# Altium project 724452_RPL-HX_Mobile_AEP_Rev0p91.PrjPcb (part 2 of 13)

## Sheet 0004_INDEX -3.SchDoc
size 848 x 558 mm
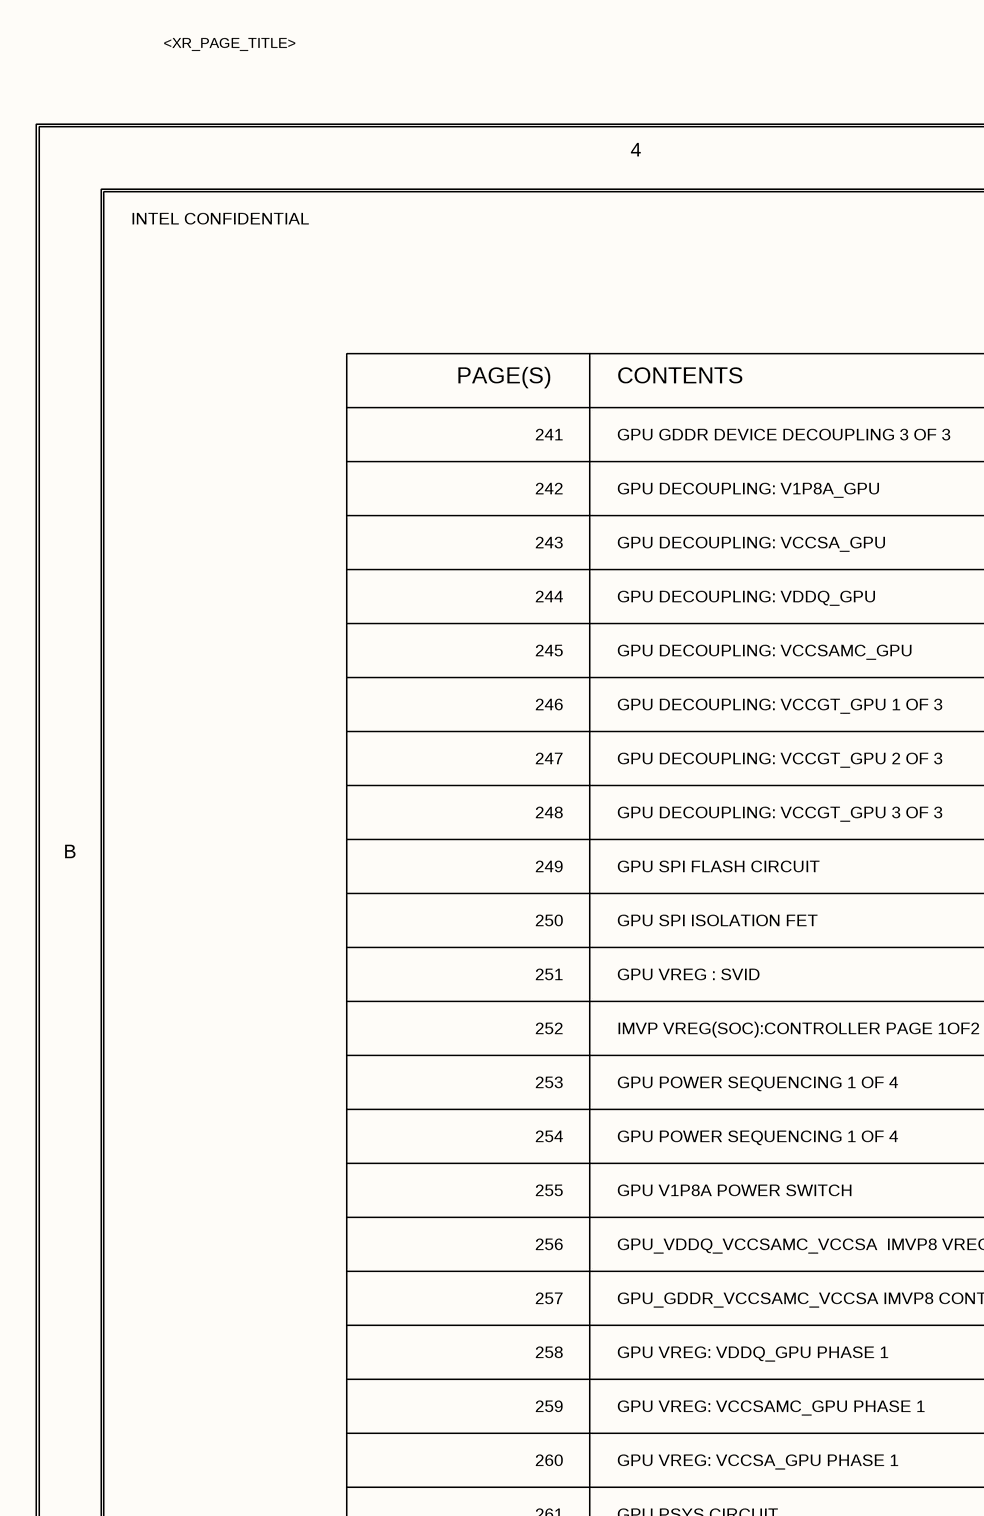
[diagram p18: 0004_INDEX -3.SchDoc, top left]
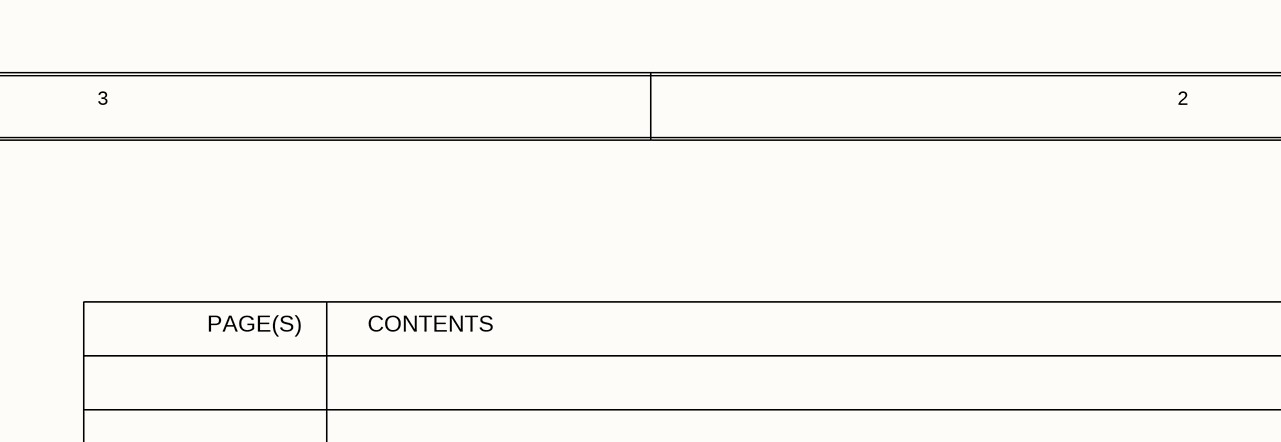
[diagram p19: 0004_INDEX -3.SchDoc, top middle]
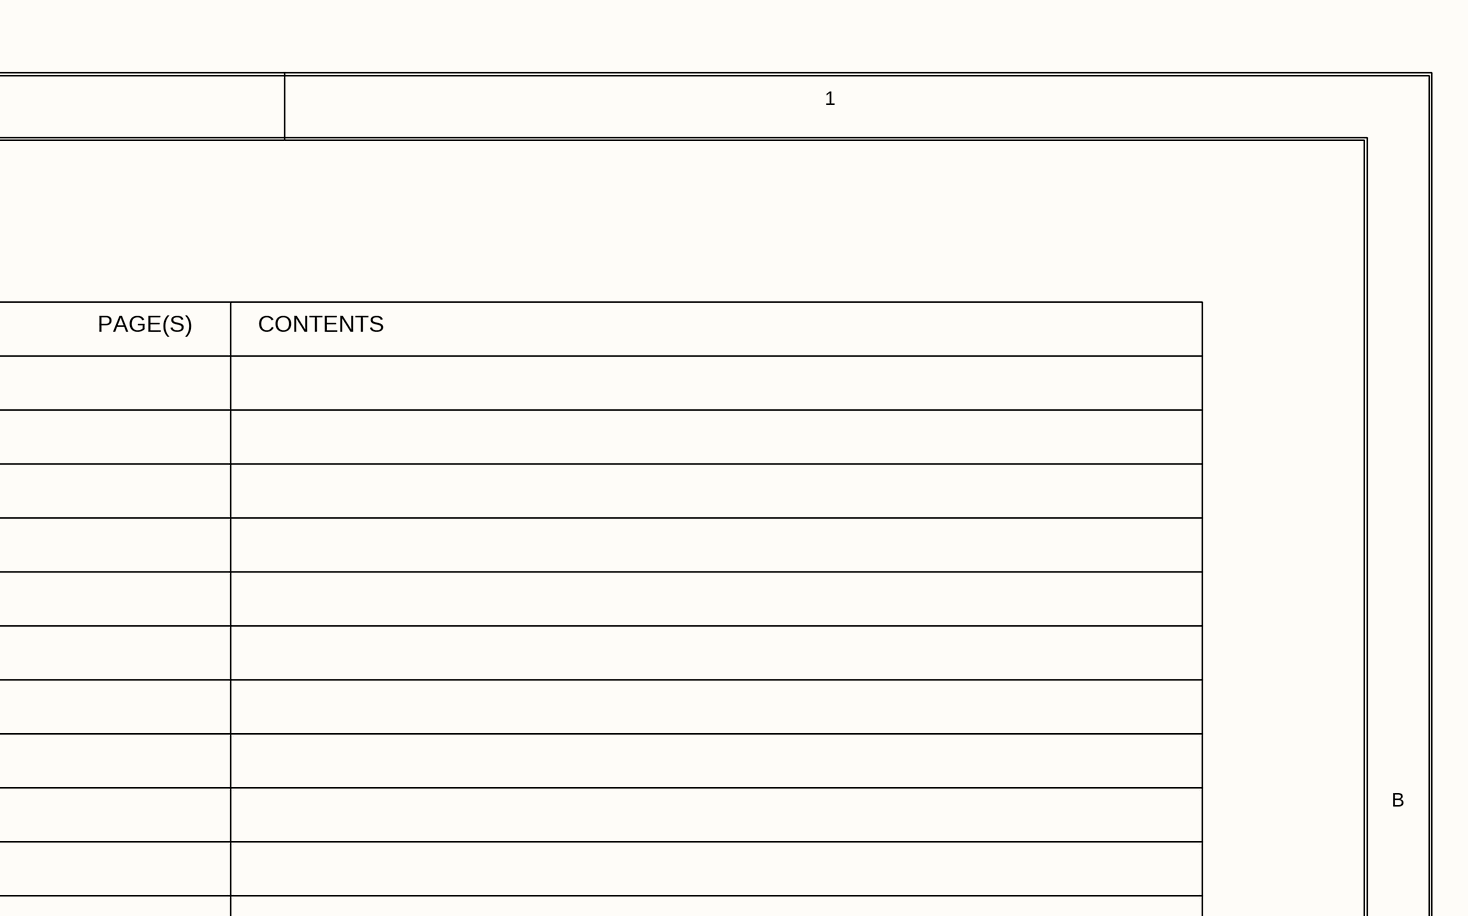
[diagram p20: 0004_INDEX -3.SchDoc, top right]
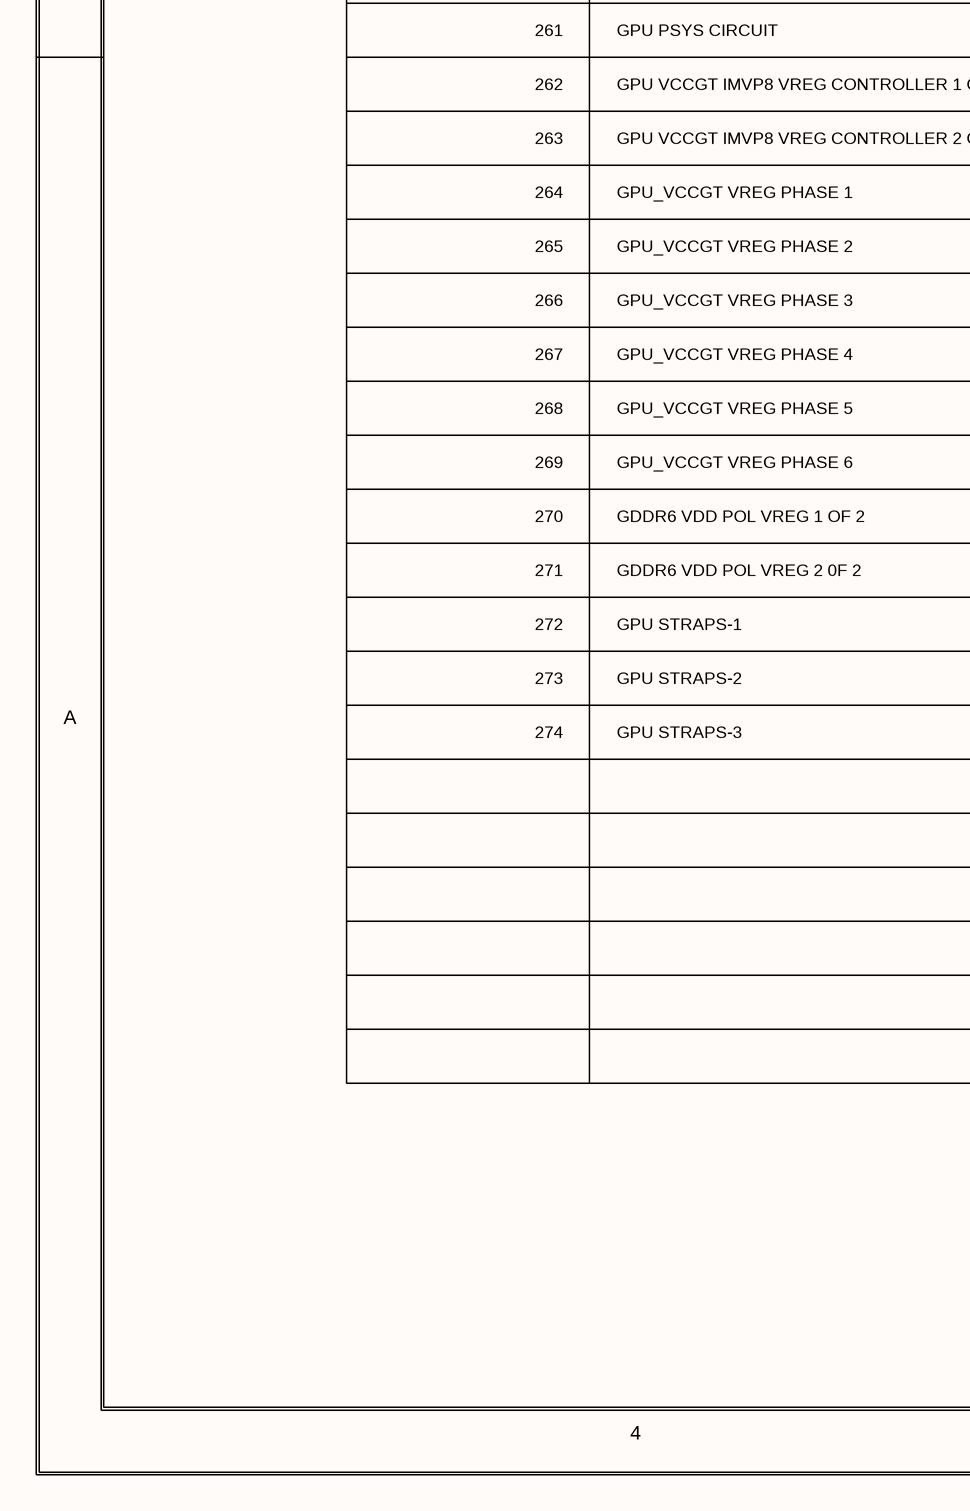
[diagram p21: 0004_INDEX -3.SchDoc, bottom left]
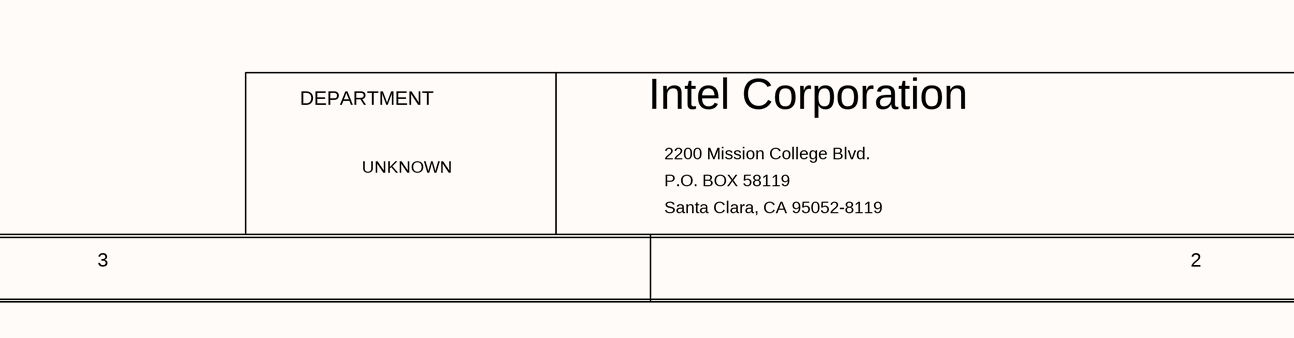
[diagram p22: 0004_INDEX -3.SchDoc, bottom middle]
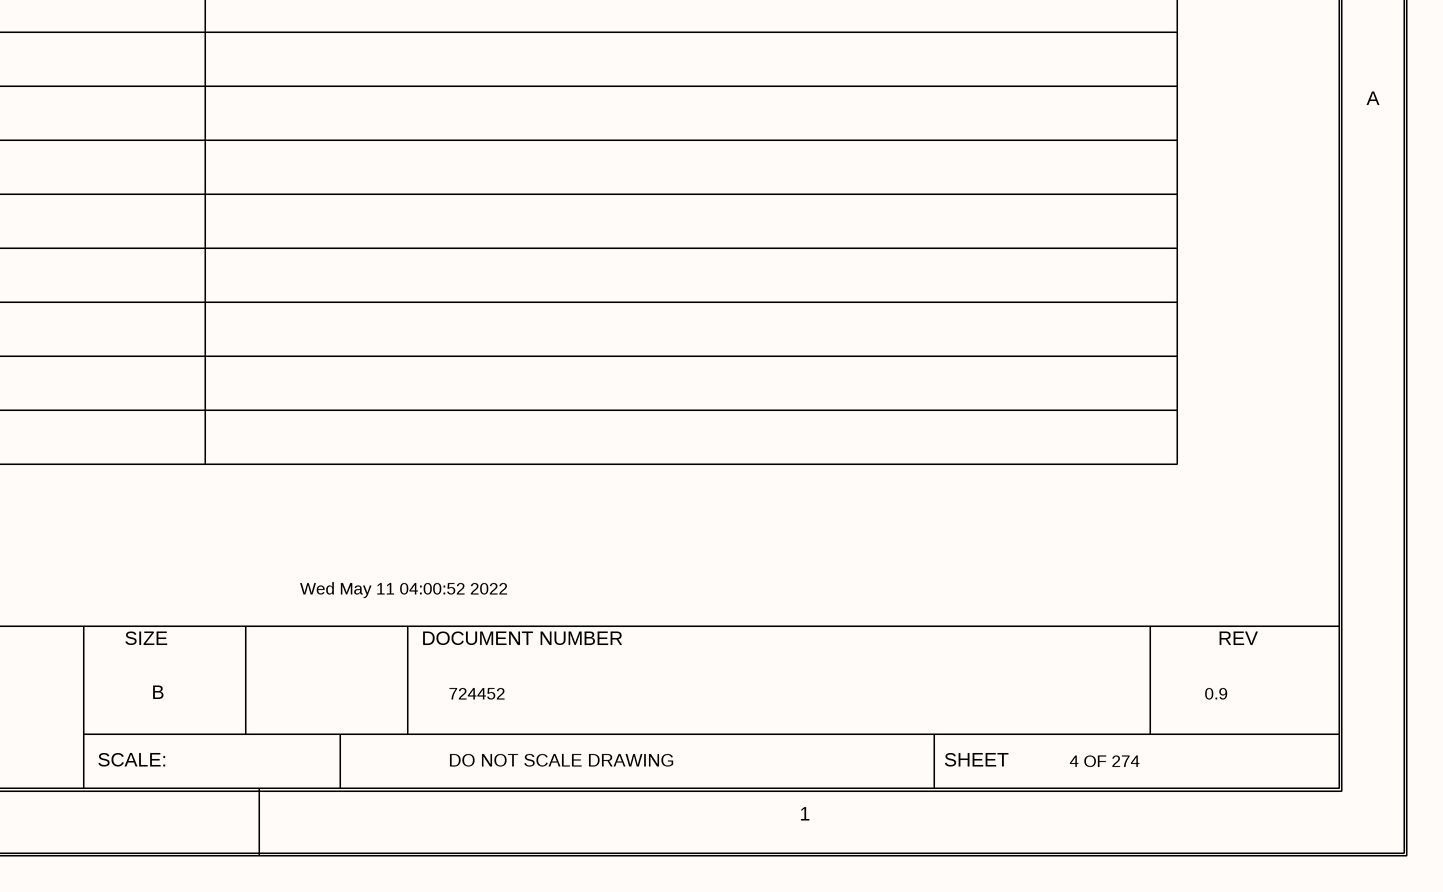
[diagram p23: 0004_INDEX -3.SchDoc, bottom right]

### Notes on the sheet
- <XR_PAGE_TITLE>
- 4
- 3
- 2
- 1
- INTEL CONFIDENTIAL
- PAGE(S)
- CONTENTS
- 241
- GPU GDDR DEVICE DECOUPLING 3 OF 3
- 242
- GPU DECOUPLING: V1P8A_GPU
- 243
- GPU DECOUPLING: VCCSA_GPU
- 244
- 245
- GPU DECOUPLING: VCCSAMC_GPU
- GPU DECOUPLING: VDDQ_GPU
- 246
- GPU DECOUPLING: VCCGT_GPU 1 OF 3
- 247
- GPU DECOUPLING: VCCGT_GPU 2 OF 3
- B
- 248
- GPU DECOUPLING: VCCGT_GPU 3 OF 3
- 249
- 250
- GPU SPI ISOLATION FET
- GPU SPI FLASH CIRCUIT
- 251
- GPU VREG : SVID
- 252
- IMVP VREG(SOC):CONTROLLER PAGE 1OF2
- 253
- GPU POWER SEQUENCING 1 OF 4
- 254
- 255
- GPU V1P8A POWER SWITCH
- 256
- GPU_VDDQ_VCCSAMC_VCCSA  IMVP8 VREG CONTROLLER
- 257
- GPU_GDDR_VCCSAMC_VCCSA IMVP8 CONTROLLER 2 OF 2
- 258
- GPU VREG: VDDQ_GPU PHASE 1
- 259
- 260
- GPU VREG: VCCSA_GPU PHASE 1
- GPU VREG: VCCSAMC_GPU PHASE 1
- 261
- GPU PSYS CIRCUIT
- 262
- GPU VCCGT IMVP8 VREG CONTROLLER 1 OF 2
- 263
- GPU VCCGT IMVP8 VREG CONTROLLER 2 OF 2
- 264
- 265
- GPU_VCCGT VREG PHASE 2
- GPU_VCCGT VREG PHASE 1
- 266
- GPU_VCCGT VREG PHASE 3
- 267
- GPU_VCCGT VREG PHASE 4
- 268
- GPU_VCCGT VREG PHASE 5
- 270
- 269
- GDDR6 VDD POL VREG 1 OF 2
- GPU_VCCGT VREG PHASE 6
- 271
- GDDR6 VDD POL VREG 2 0F 2
- 272
- GPU STRAPS-1
- A
- 273
- GPU STRAPS-2
- 274
- GPU STRAPS-3
- Wed May 11 04:00:52 2022
- SIZE
- DOCUMENT NUMBER
- REV
- DEPARTMENT
- Intel Corporation
- 2200 Mission College Blvd.
- 724452
- 0.9
- UNKNOWN
- Santa Clara, CA 95052-8119
- P.O. BOX 58119
- SCALE:
- DO NOT SCALE DRAWING
- SHEET
- 4 OF 274

## Sheet 0005_BLOCK DIAGRAM - MA.SchDoc
size 848 x 558 mm
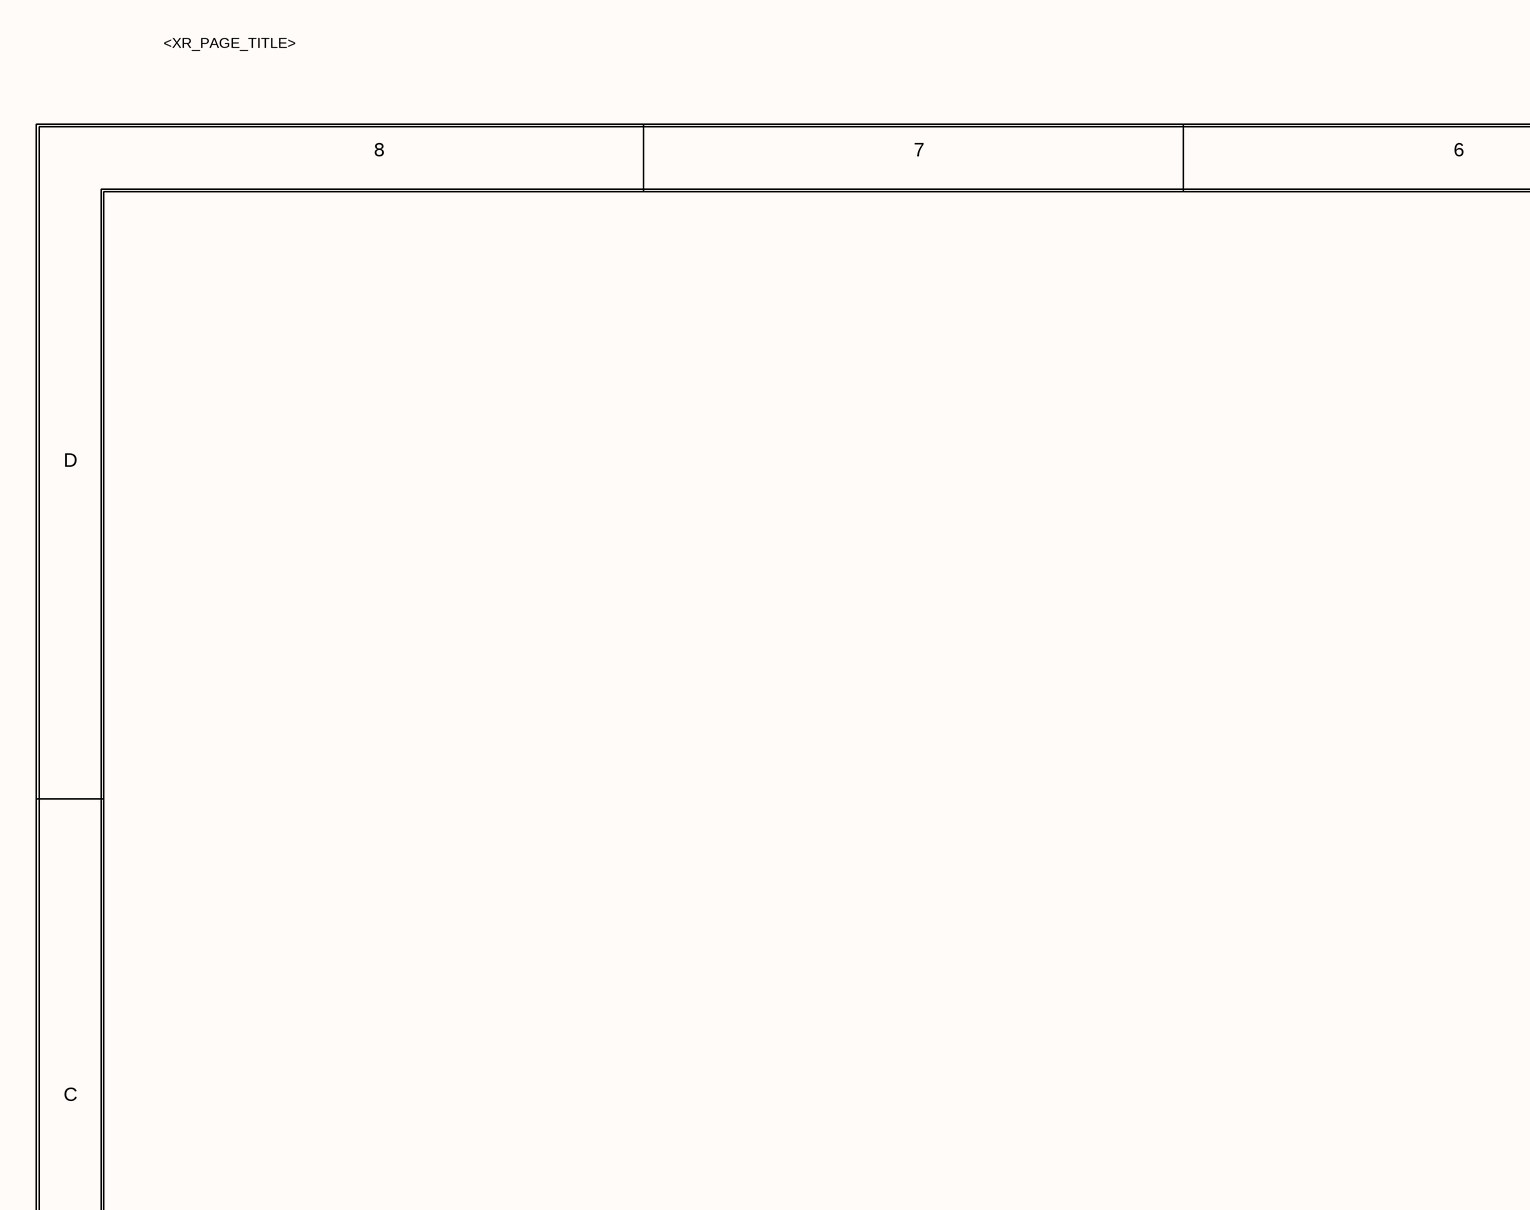
[diagram p24: 0005_BLOCK DIAGRAM - MA.SchDoc, top left]
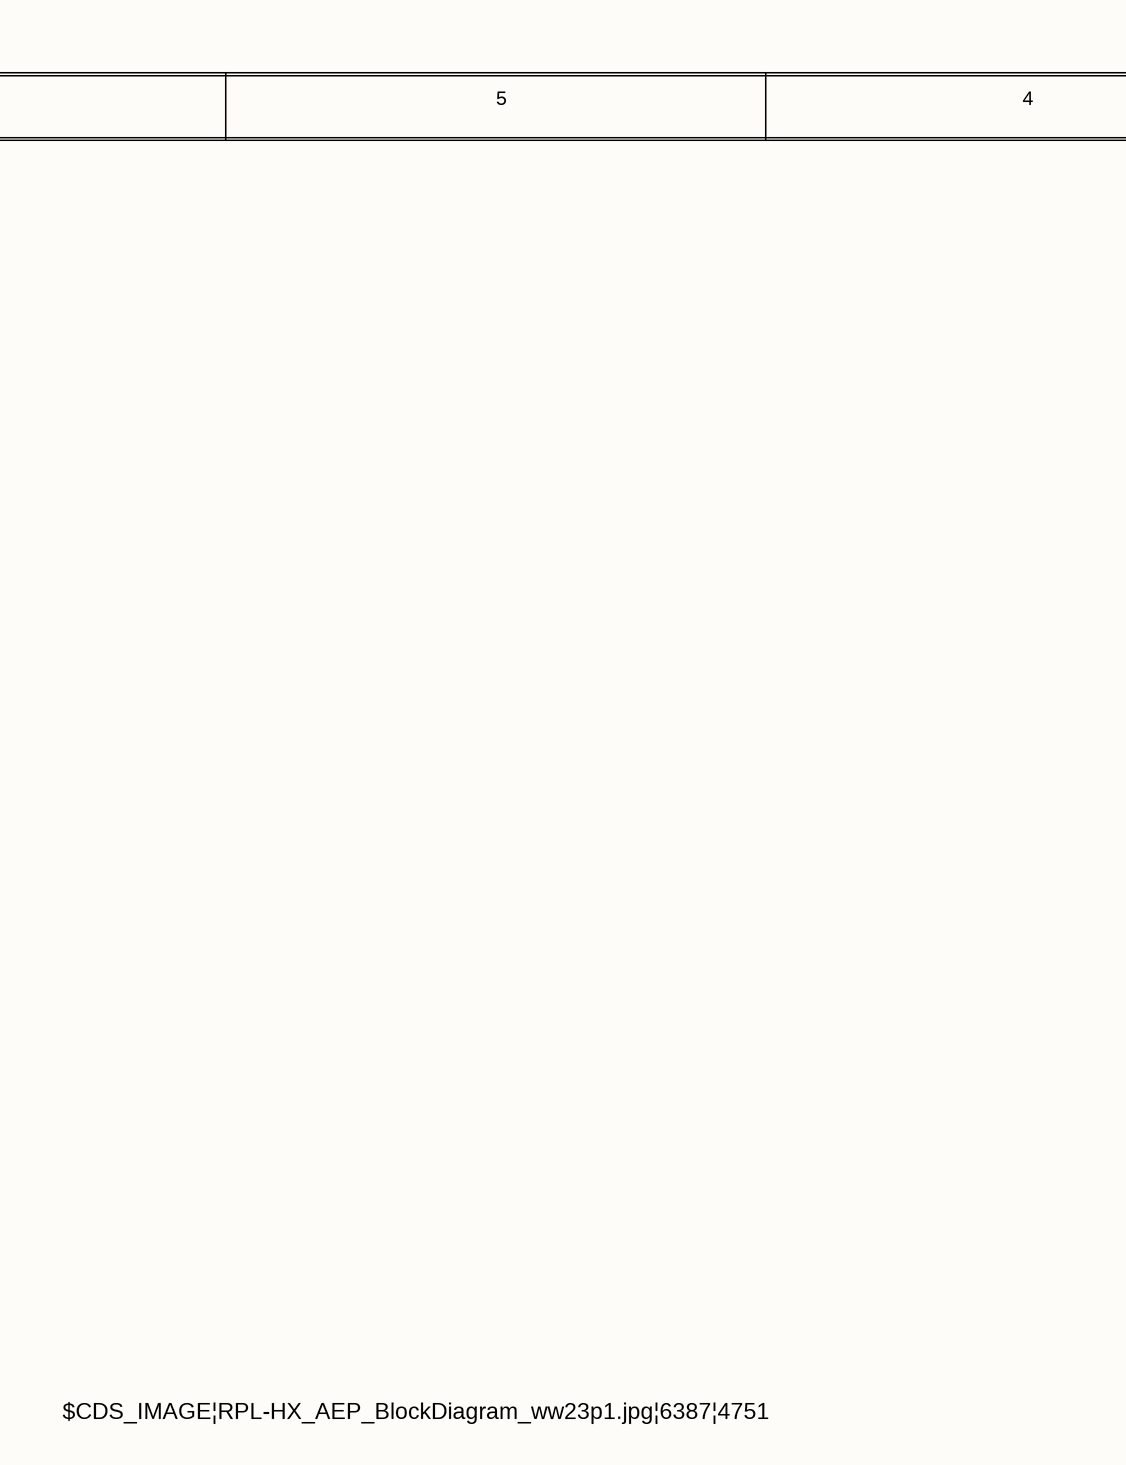
[diagram p25: 0005_BLOCK DIAGRAM - MA.SchDoc, top middle]
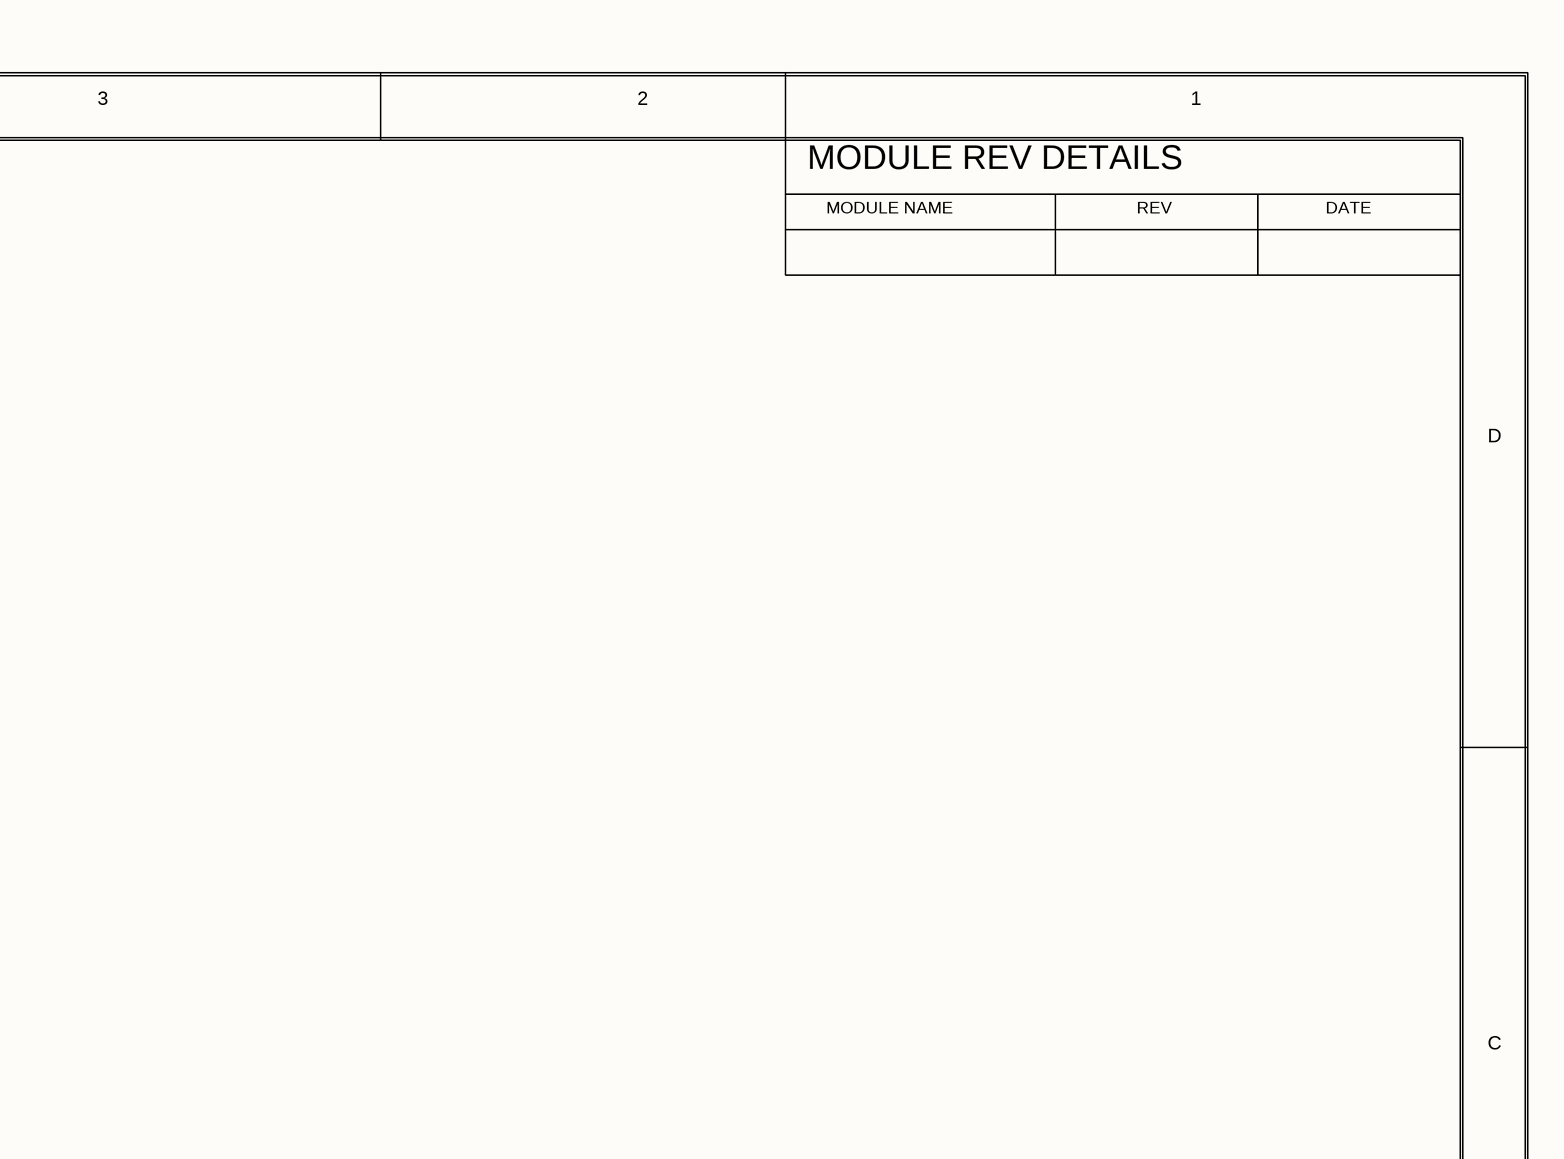
[diagram p26: 0005_BLOCK DIAGRAM - MA.SchDoc, top right]
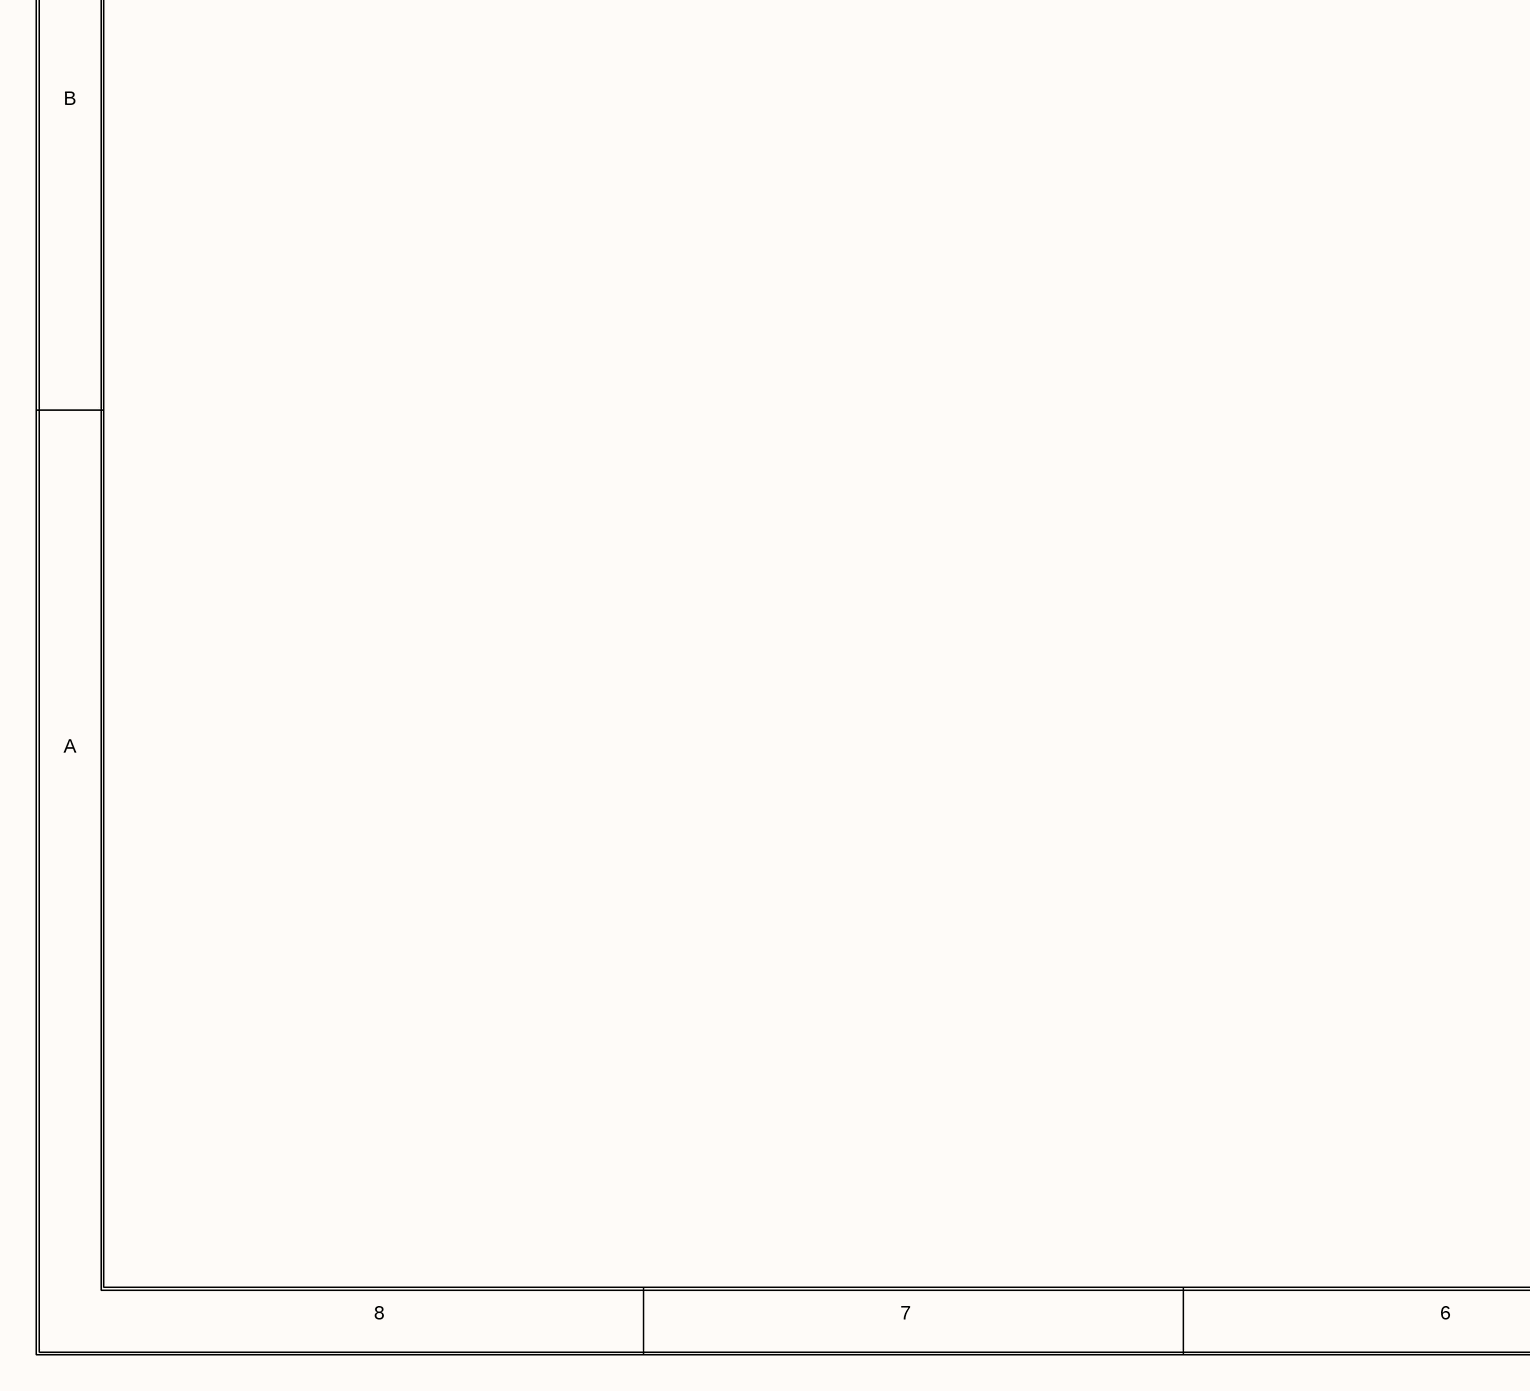
[diagram p27: 0005_BLOCK DIAGRAM - MA.SchDoc, bottom left]
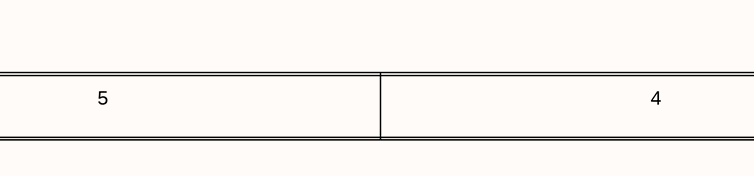
[diagram p28: 0005_BLOCK DIAGRAM - MA.SchDoc, bottom middle]
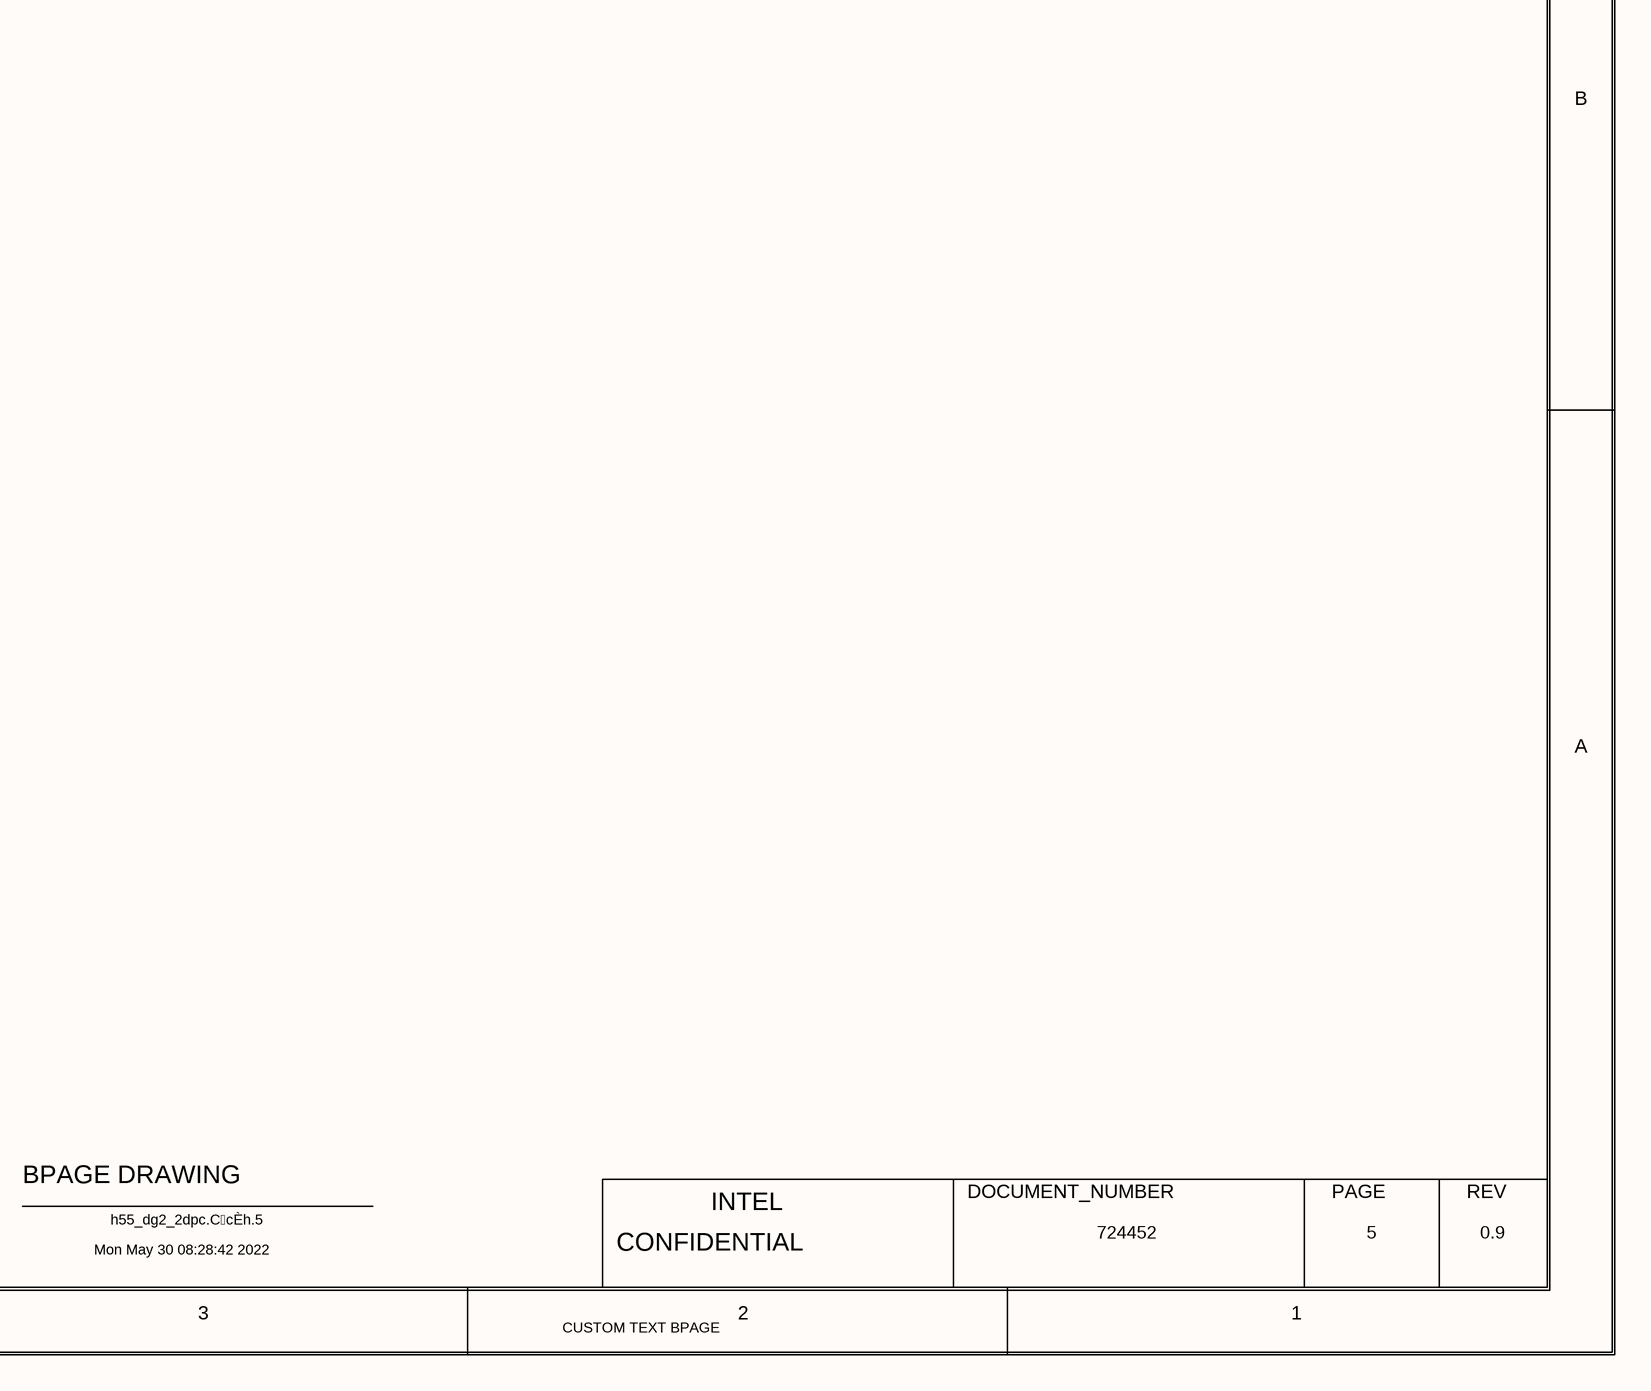
[diagram p29: 0005_BLOCK DIAGRAM - MA.SchDoc, bottom right]

### Notes on the sheet
- <XR_PAGE_TITLE>
- 8
- 7
- 6
- 5
- 4
- 3
- 2
- 1
- MODULE REV DETAILS
- MODULE NAME
- REV
- DATE
- D
- C
- $CDS_IMAGE|RPL-HX_AEP_BlockDiagram_ww23p1.jpg|6387|4751
- B
- A
- BPAGE DRAWING
- INTEL
- DOCUMENT_NUMBER
- PAGE
- Mon May 30 08:28:42 2022
- h55_dg2_2dpc.CcÈh.5
- CONFIDENTIAL
- 724452
- 0.9
- CUSTOM TEXT BPAGE

## Sheet 0006_BLOCK DIAGRAM - PO.SchDoc
size 848 x 558 mm
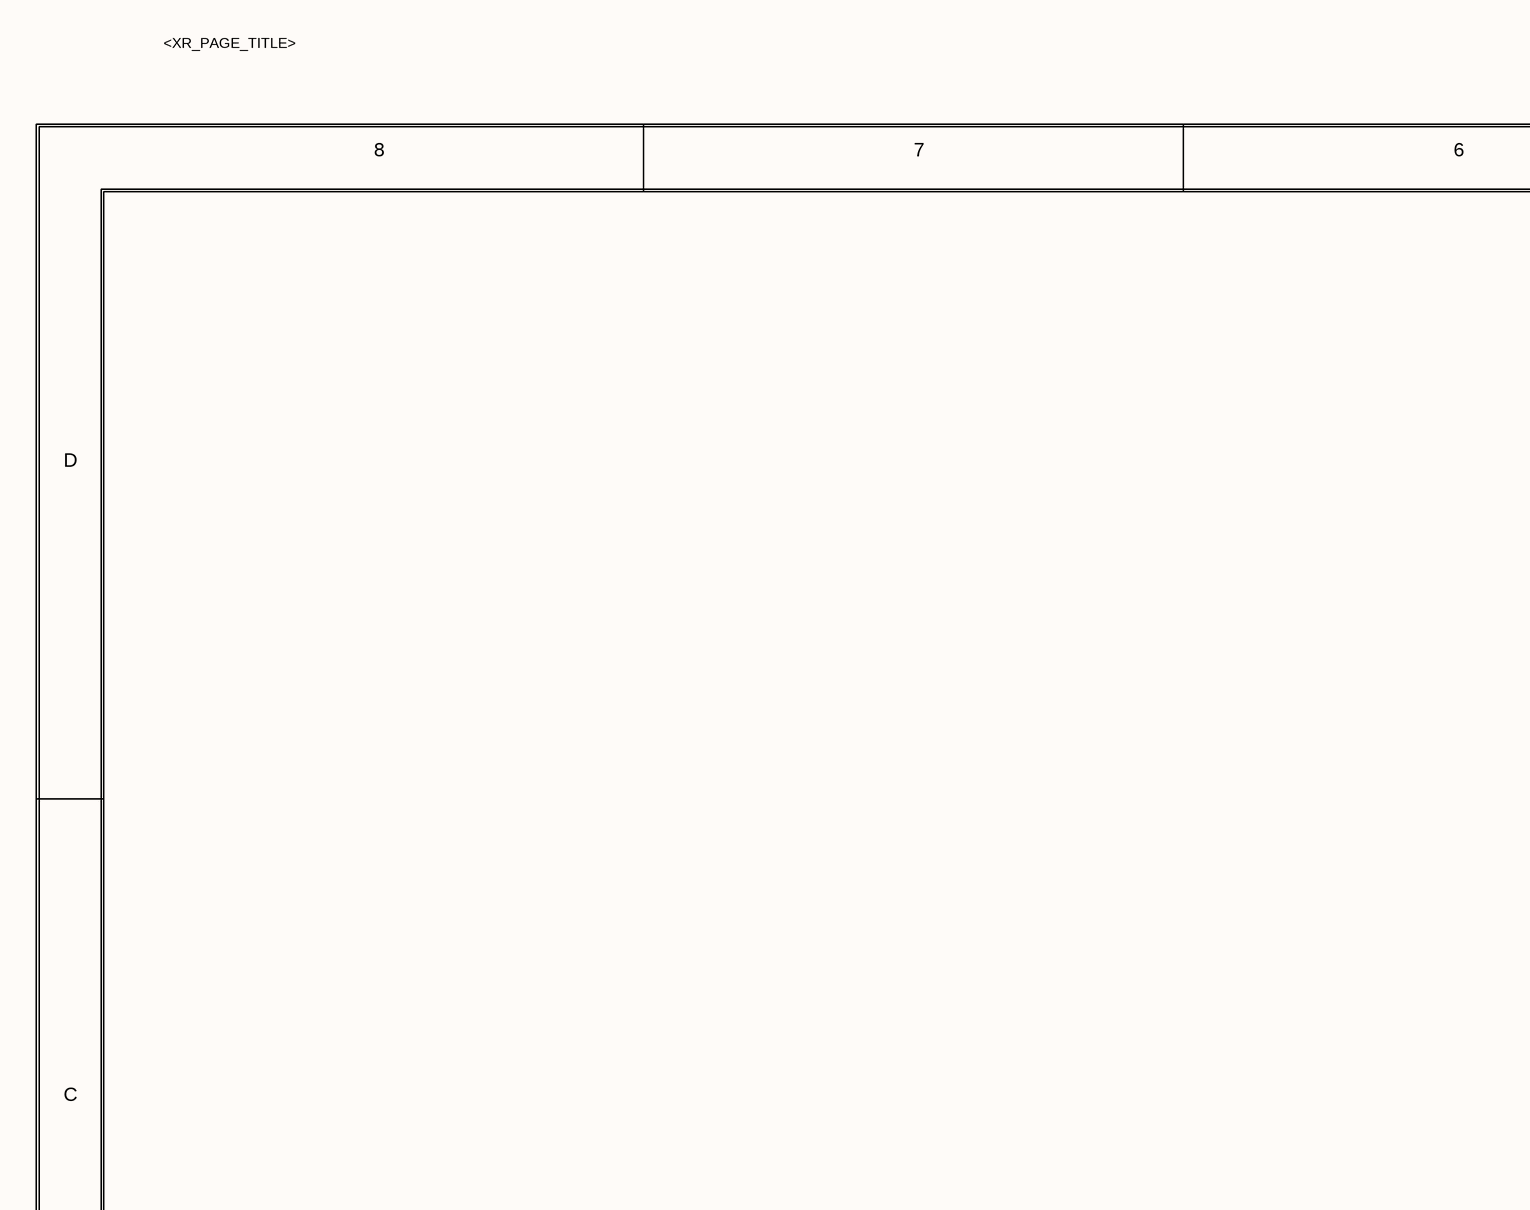
[diagram p30: 0006_BLOCK DIAGRAM - PO.SchDoc, top left]
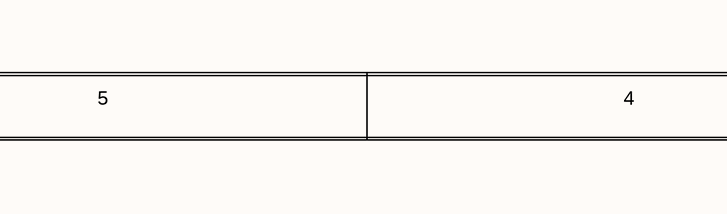
[diagram p31: 0006_BLOCK DIAGRAM - PO.SchDoc, top middle]
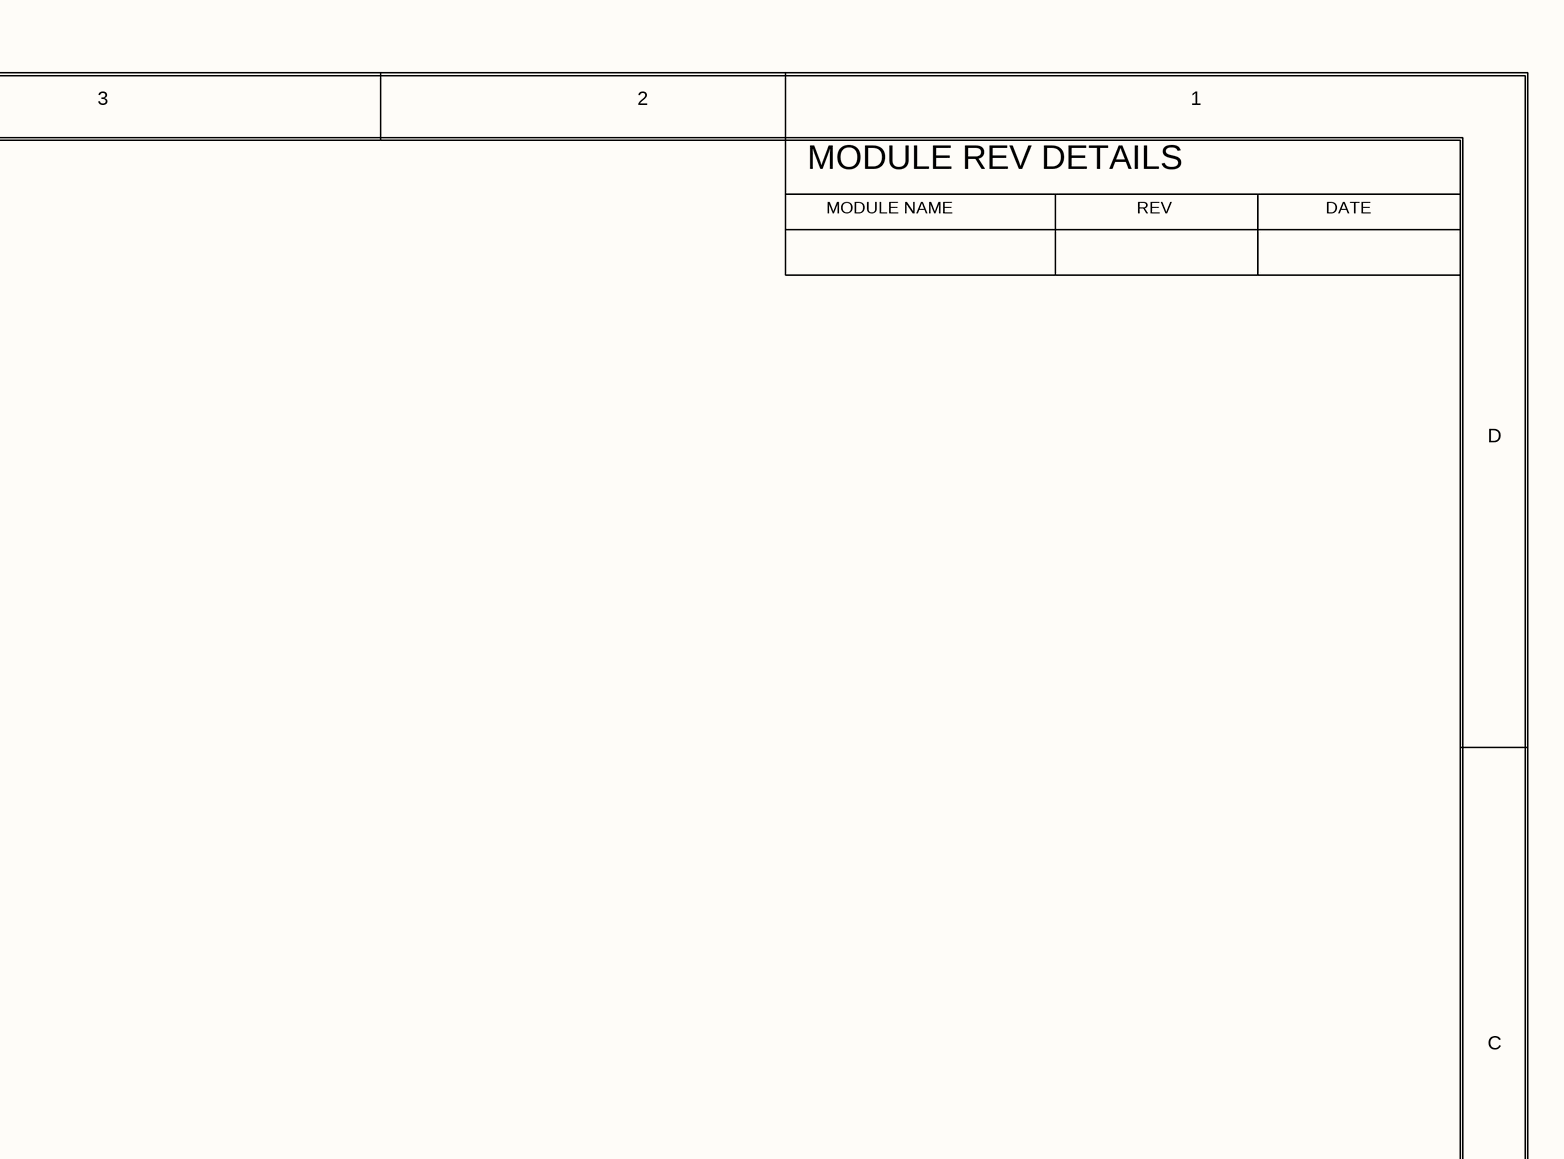
[diagram p32: 0006_BLOCK DIAGRAM - PO.SchDoc, top right]
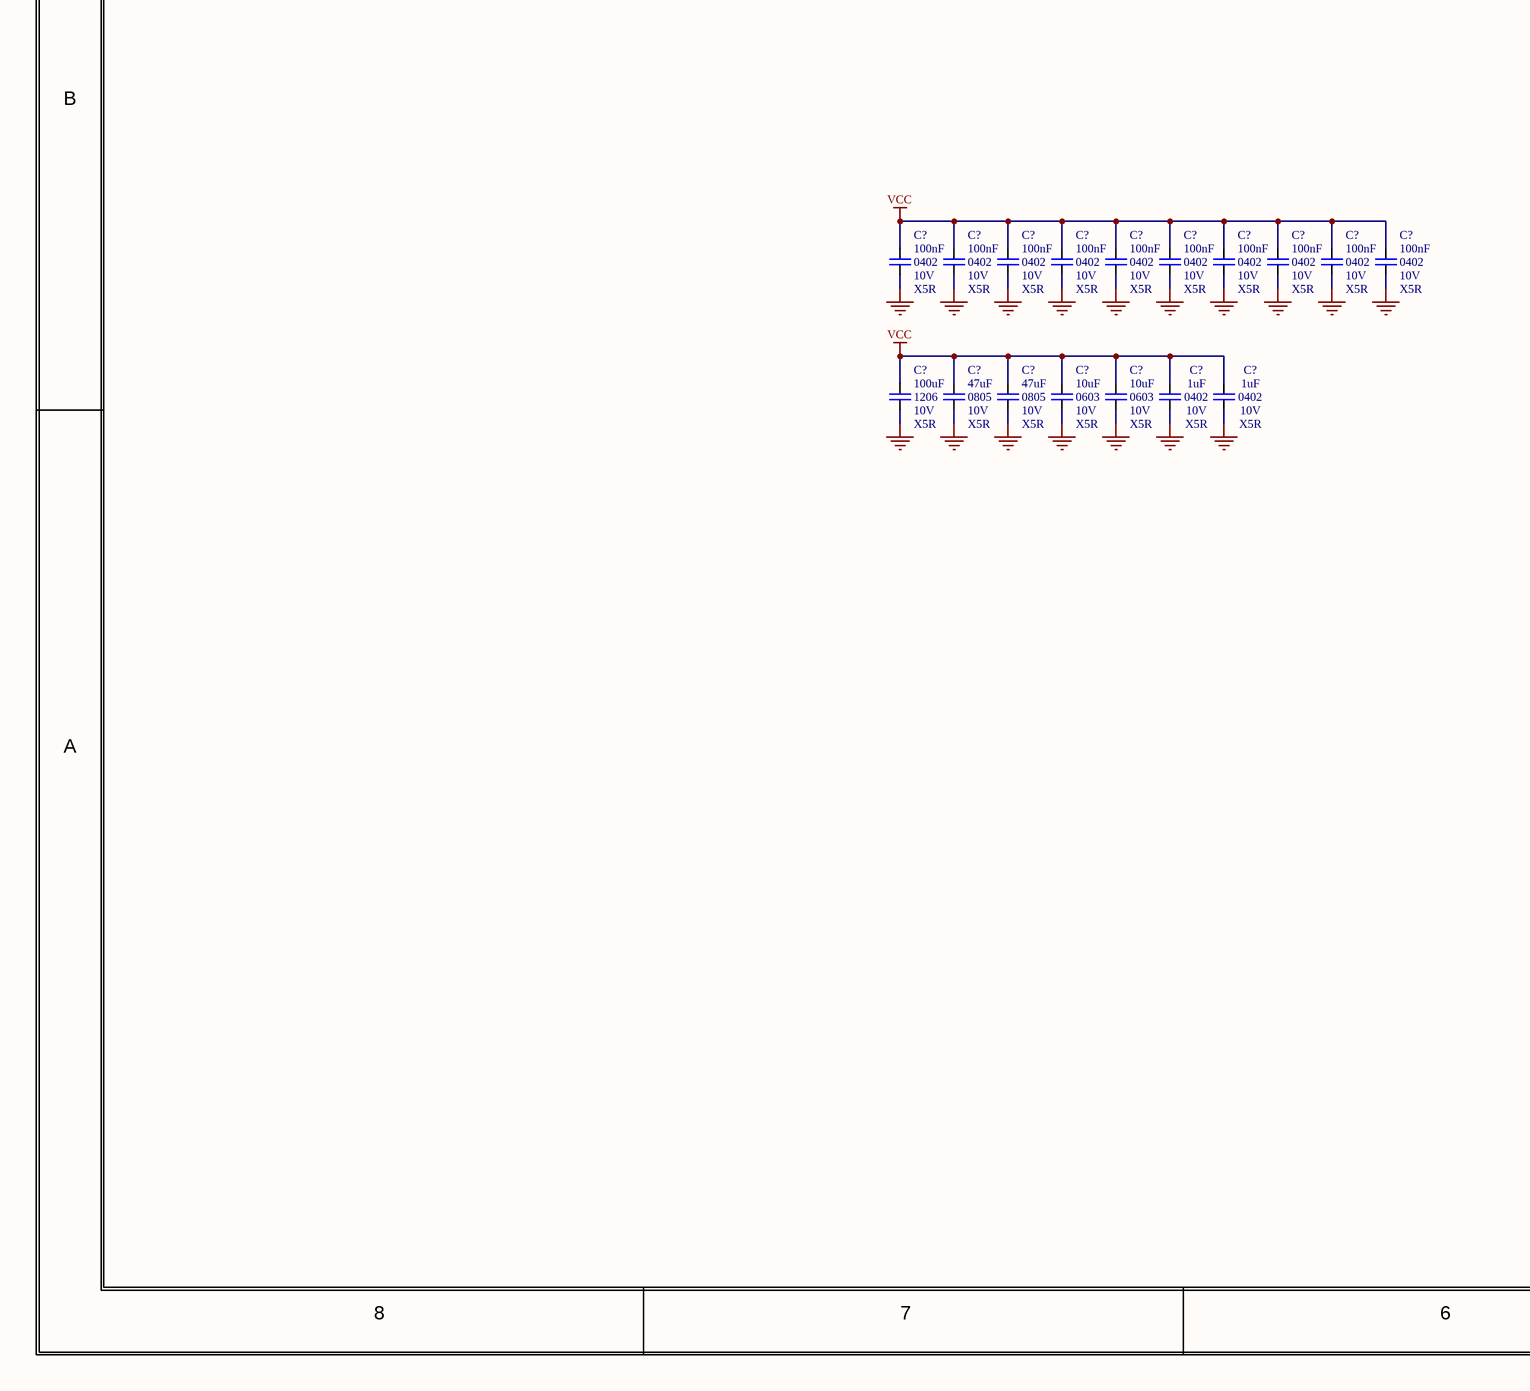
[diagram p33: 0006_BLOCK DIAGRAM - PO.SchDoc, bottom left]
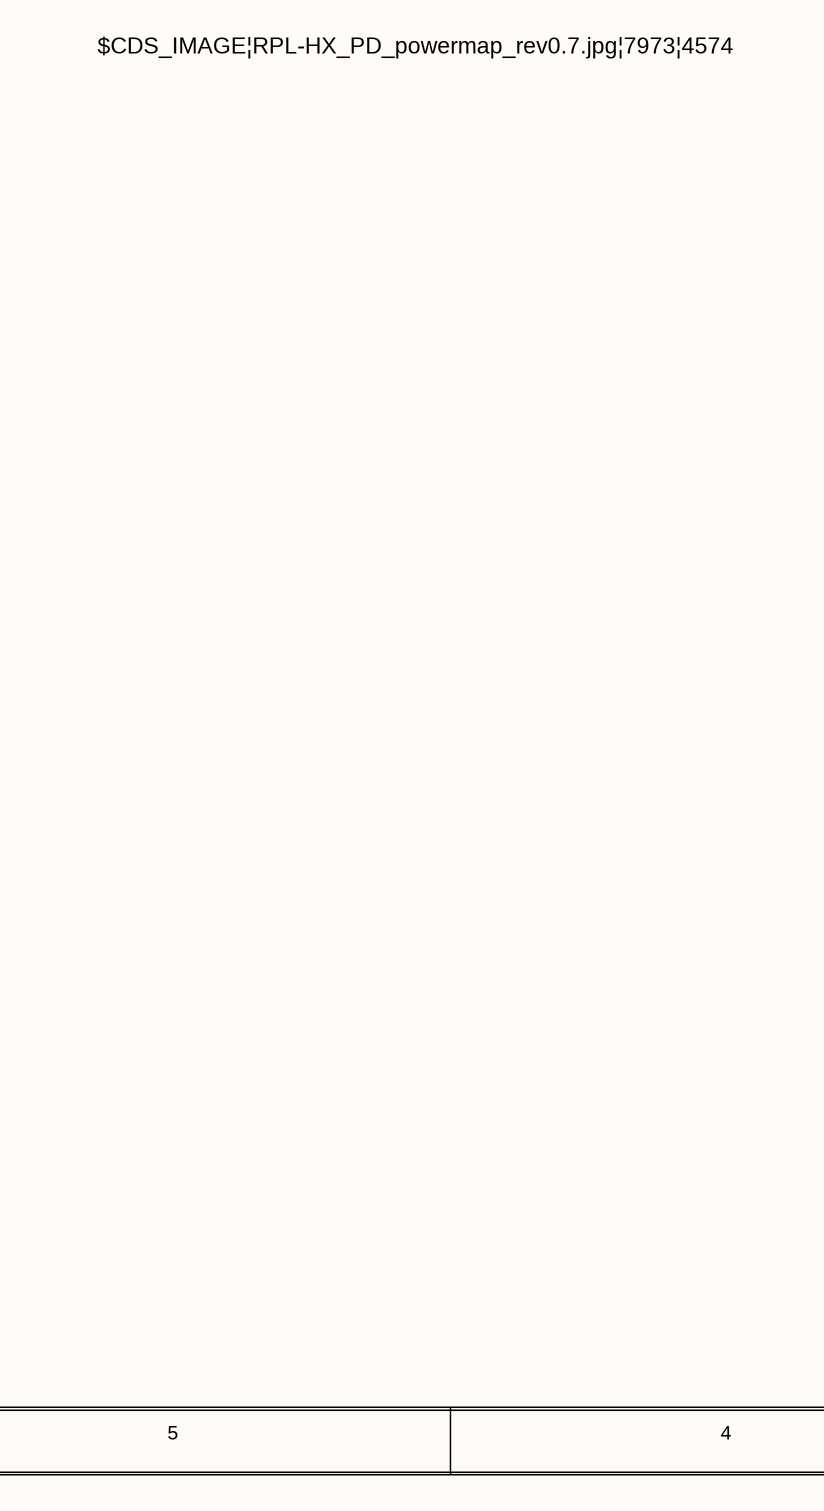
[diagram p34: 0006_BLOCK DIAGRAM - PO.SchDoc, bottom middle]
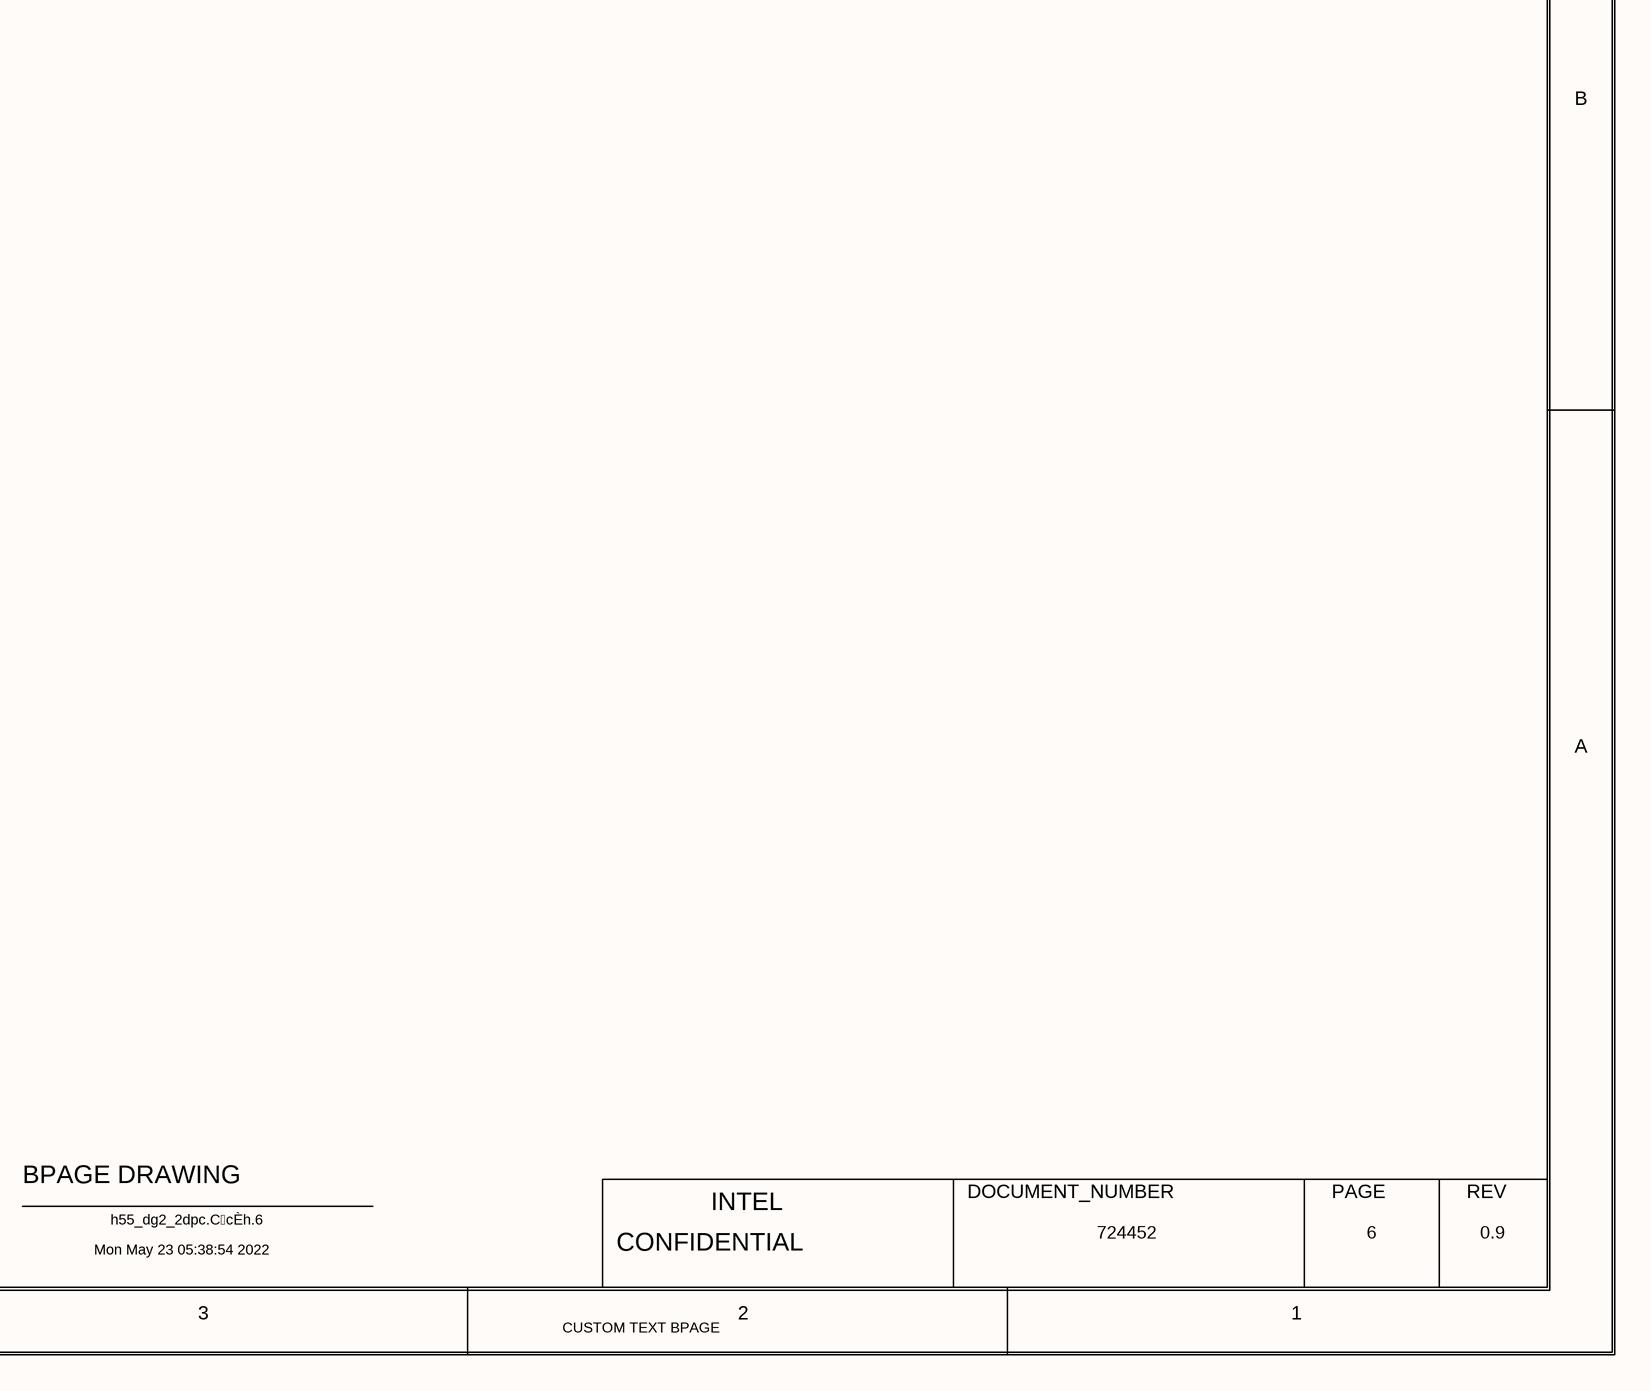
[diagram p35: 0006_BLOCK DIAGRAM - PO.SchDoc, bottom right]

### Parts
(Parts that share a designator on the sheet are numbered #1, #2 ... from top to bottom, then left to right.)
C?#1  value 100nF  Case/Package: 0402  Voltage: 10V  Dielectric: X5R  [CAPC0402]
C?#2  value 100nF  Case/Package: 0402  Voltage: 10V  Dielectric: X5R  [CAPC0402]
C?#3  value 100nF  Case/Package: 0402  Voltage: 10V  Dielectric: X5R  [CAPC0402]
C?#4  value 100nF  Case/Package: 0402  Voltage: 10V  Dielectric: X5R  [CAPC0402]
C?#5  value 100nF  Case/Package: 0402  Voltage: 10V  Dielectric: X5R  [CAPC0402]
C?#6  value 100nF  Case/Package: 0402  Voltage: 10V  Dielectric: X5R  [CAPC0402]
C?#7  value 100nF  Case/Package: 0402  Voltage: 10V  Dielectric: X5R  [CAPC0402]
C?#8  value 100nF  Case/Package: 0402  Voltage: 10V  Dielectric: X5R  [CAPC0402]
C?#9  value 100nF  Case/Package: 0402  Voltage: 10V  Dielectric: X5R  [CAPC0402]
C?#10  value 100nF  Case/Package: 0402  Voltage: 10V  Dielectric: X5R  [CAPC0402]
C?#11  value 100uF  Case/Package: 1206  Voltage: 10V  Dielectric: X5R
C?#12  value 47uF  Case/Package: 0805  Voltage: 10V  Dielectric: X5R  [capc0805]
C?#13  value 47uF  Case/Package: 0805  Voltage: 10V  Dielectric: X5R  [capc0805]
C?#14  value 10uF  Case/Package: 0603  Voltage: 10V  Dielectric: X5R  [CAPC0603]
C?#15  value 10uF  Case/Package: 0603  Voltage: 10V  Dielectric: X5R  [CAPC0603]
C?#16  value 1uF  Case/Package: 0402  Voltage: 10V  Dielectric: X5R  [CAPC0402]
C?#17  value 1uF  Case/Package: 0402  Voltage: 10V  Dielectric: X5R  [CAPC0402]

### Nets
GND: C?#1.2 C?#2.2 C?#3.2 C?#4.2 C?#5.2 C?#6.2 C?#7.2 C?#8.2 C?#9.2 C?#10.2 C?#11.1 C?#12.1 C?#13.1 C?#14.1 C?#15.1 C?#16.1 C?#17.1  [project net EXP_A_RX_4_DP]
VCC: C?#1.1 C?#2.1 C?#3.1 C?#4.1 C?#5.1 C?#6.1 C?#7.1 C?#8.1 C?#9.1 C?#10.1 C?#11.2 C?#12.2 C?#13.2 C?#14.2 C?#15.2 C?#16.2 C?#17.2

### Notes on the sheet
- <XR_PAGE_TITLE>
- 8
- 7
- 6
- 5
- 4
- 3
- 2
- 1
- MODULE REV DETAILS
- MODULE NAME
- REV
- DATE
- D
- C
- $CDS_IMAGE|RPL-HX_PD_powermap_rev0.7.jpg|7973|4574
- B
- A
- BPAGE DRAWING
- INTEL
- DOCUMENT_NUMBER
- PAGE
- Mon May 23 05:38:54 2022
- h55_dg2_2dpc.CcÈh.6
- CONFIDENTIAL
- 724452
- 0.9
- CUSTOM TEXT BPAGE

### Library data of the parts
C?#1-C?#10 = Cap: CAP CER 100nF 10V X5R 0402
C?#11 = Cap: CAP CER 100uF 10V X5R 1206
C?#12 C?#13 = Cap: CAP CER 47uF 10V X5R 0805
C?#14 C?#15 = Cap: CAP CER 10uF 10V X5R 0603
C?#16 C?#17 = Cap: CAP CER 1uF 10V X5R 0402

## Sheet 0012_Processor - PEG, D.SchDoc
size A3
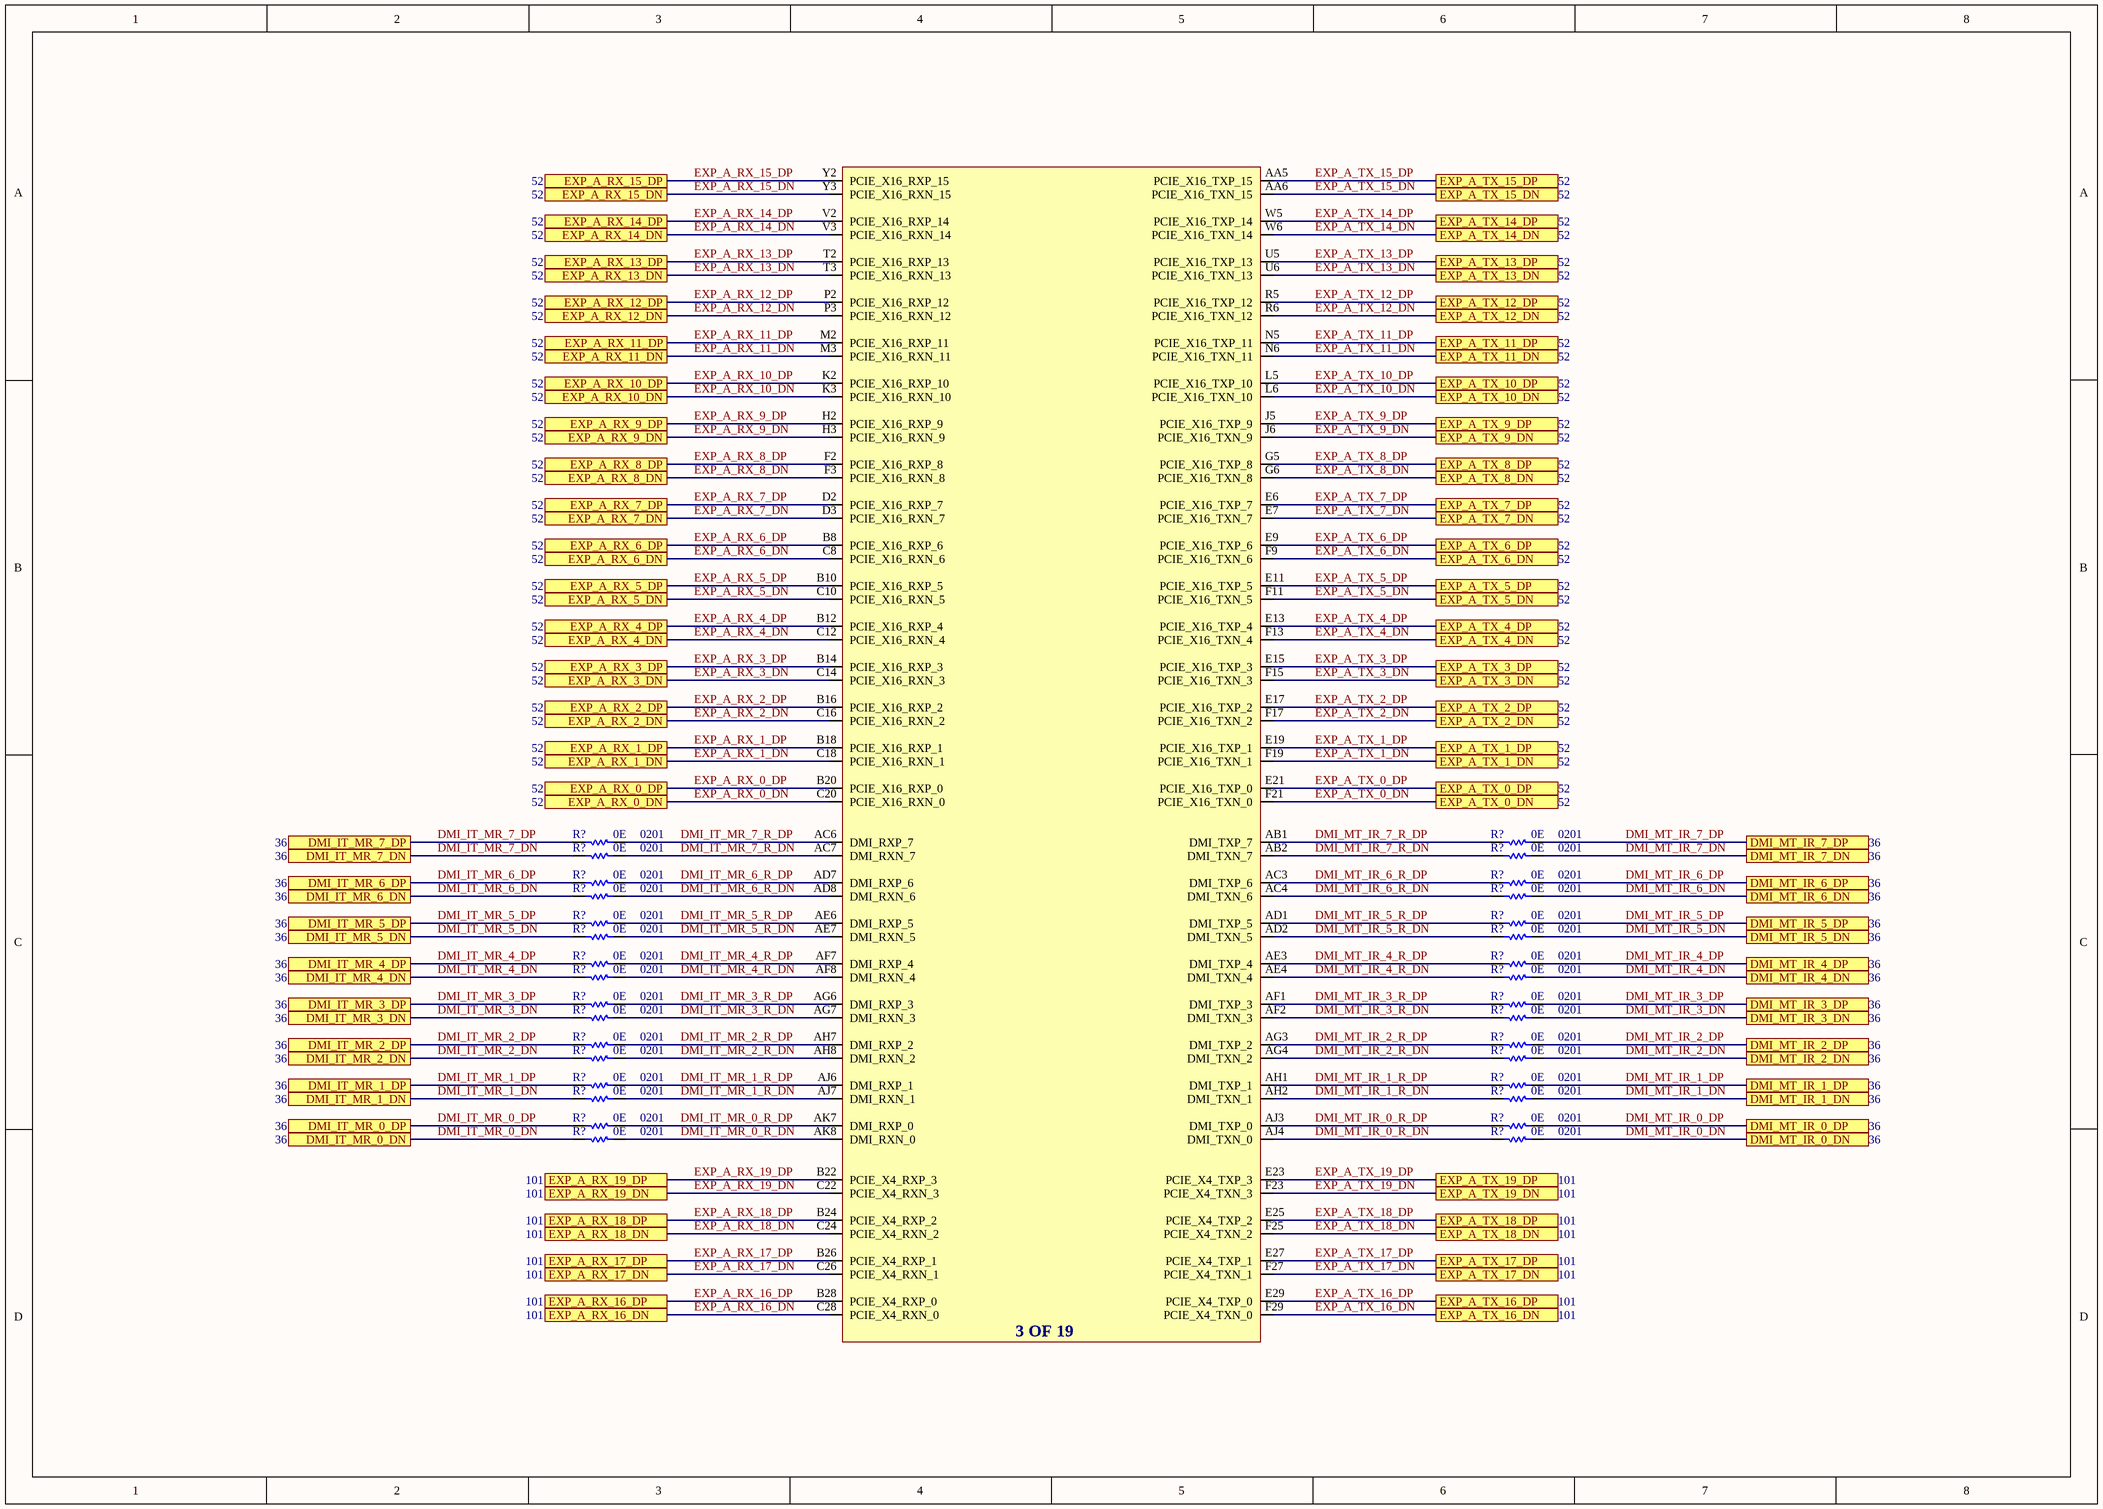
[diagram p36: 0012_Processor - PEG, D.SchDoc]

### Parts
(Parts that share a designator on the sheet are numbered #1, #2 ... from top to bottom, then left to right.)
R?#1  value 0E  Case/Package: 0201  [RESC0201]  (hidden comment: Res)
R?#2  value 0E  Case/Package: 0201  [RESC0201]  (hidden comment: Res)
R?#3  value 0E  Case/Package: 0201  [RESC0201]  (hidden comment: Res)
R?#4  value 0E  Case/Package: 0201  [RESC0201]  (hidden comment: Res)
R?#5  value 0E  Case/Package: 0201  [RESC0201]  (hidden comment: Res)
R?#6  value 0E  Case/Package: 0201  [RESC0201]  (hidden comment: Res)
R?#7  value 0E  Case/Package: 0201  [RESC0201]  (hidden comment: Res)
R?#8  value 0E  Case/Package: 0201  [RESC0201]  (hidden comment: Res)
R?#9  value 0E  Case/Package: 0201  [RESC0201]  (hidden comment: Res)
R?#10  value 0E  Case/Package: 0201  [RESC0201]  (hidden comment: Res)
R?#11  value 0E  Case/Package: 0201  [RESC0201]  (hidden comment: Res)
R?#12  value 0E  Case/Package: 0201  [RESC0201]  (hidden comment: Res)
R?#13  value 0E  Case/Package: 0201  [RESC0201]  (hidden comment: Res)
R?#14  value 0E  Case/Package: 0201  [RESC0201]  (hidden comment: Res)
R?#15  value 0E  Case/Package: 0201  [RESC0201]  (hidden comment: Res)
R?#16  value 0E  Case/Package: 0201  [RESC0201]  (hidden comment: Res)
R?#17  value 0E  Case/Package: 0201  [RESC0201]  (hidden comment: Res)
R?#18  value 0E  Case/Package: 0201  [RESC0201]  (hidden comment: Res)
R?#19  value 0E  Case/Package: 0201  [RESC0201]  (hidden comment: Res)
R?#20  value 0E  Case/Package: 0201  [RESC0201]  (hidden comment: Res)
R?#21  value 0E  Case/Package: 0201  [RESC0201]  (hidden comment: Res)
R?#22  value 0E  Case/Package: 0201  [RESC0201]  (hidden comment: Res)
R?#23  value 0E  Case/Package: 0201  [RESC0201]  (hidden comment: Res)
R?#24  value 0E  Case/Package: 0201  [RESC0201]  (hidden comment: Res)
R?#25  value 0E  Case/Package: 0201  [RESC0201]  (hidden comment: Res)
R?#26  value 0E  Case/Package: 0201  [RESC0201]  (hidden comment: Res)
R?#27  value 0E  Case/Package: 0201  [RESC0201]  (hidden comment: Res)
R?#28  value 0E  Case/Package: 0201  [RESC0201]  (hidden comment: Res)
R?#29  value 0E  Case/Package: 0201  [RESC0201]  (hidden comment: Res)
R?#30  value 0E  Case/Package: 0201  [RESC0201]  (hidden comment: Res)
R?#31  value 0E  Case/Package: 0201  [RESC0201]  (hidden comment: Res)
R?#32  value 0E  Case/Package: 0201  [RESC0201]  (hidden comment: Res)
U1401  C_RPL_HX_EXT  (value not drawn)  (part C of 19)

### Ports
DMI_IT_MR_0_DN, DMI_IT_MR_0_DP, DMI_IT_MR_1_DN, DMI_IT_MR_1_DP, DMI_IT_MR_2_DN, DMI_IT_MR_2_DP, DMI_IT_MR_3_DN, DMI_IT_MR_3_DP, DMI_IT_MR_4_DN, DMI_IT_MR_4_DP, DMI_IT_MR_5_DN, DMI_IT_MR_5_DP, DMI_IT_MR_6_DN, DMI_IT_MR_6_DP, DMI_IT_MR_7_DN, DMI_IT_MR_7_DP, DMI_MT_IR_0_DN, DMI_MT_IR_0_DP, DMI_MT_IR_1_DN, DMI_MT_IR_1_DP, DMI_MT_IR_2_DN, DMI_MT_IR_2_DP, DMI_MT_IR_3_DN, DMI_MT_IR_3_DP, DMI_MT_IR_4_DN, DMI_MT_IR_4_DP, DMI_MT_IR_5_DN, DMI_MT_IR_5_DP, DMI_MT_IR_6_DN, DMI_MT_IR_6_DP, DMI_MT_IR_7_DN, DMI_MT_IR_7_DP, EXP_A_RX_0_DN, EXP_A_RX_0_DP, EXP_A_RX_1_DN, EXP_A_RX_1_DP, EXP_A_RX_2_DN, EXP_A_RX_2_DP, EXP_A_RX_3_DN, EXP_A_RX_3_DP, EXP_A_RX_4_DN, EXP_A_RX_4_DP, EXP_A_RX_5_DN, EXP_A_RX_5_DP, EXP_A_RX_6_DN, EXP_A_RX_6_DP, EXP_A_RX_7_DN, EXP_A_RX_7_DP, EXP_A_RX_8_DN, EXP_A_RX_8_DP, EXP_A_RX_9_DN, EXP_A_RX_9_DP, EXP_A_RX_10_DN, EXP_A_RX_10_DP, EXP_A_RX_11_DN, EXP_A_RX_11_DP, EXP_A_RX_12_DN, EXP_A_RX_12_DP, EXP_A_RX_13_DN, EXP_A_RX_13_DP, EXP_A_RX_14_DN, EXP_A_RX_14_DP, EXP_A_RX_15_DN, EXP_A_RX_15_DP, EXP_A_RX_16_DN, EXP_A_RX_16_DP, EXP_A_RX_17_DN, EXP_A_RX_17_DP, EXP_A_RX_18_DN, EXP_A_RX_18_DP, EXP_A_RX_19_DN, EXP_A_RX_19_DP, EXP_A_TX_0_DN, EXP_A_TX_0_DP, EXP_A_TX_1_DN, EXP_A_TX_1_DP, EXP_A_TX_2_DN, EXP_A_TX_2_DP, EXP_A_TX_3_DN, EXP_A_TX_3_DP, EXP_A_TX_4_DN, EXP_A_TX_4_DP, EXP_A_TX_5_DN, EXP_A_TX_5_DP, EXP_A_TX_6_DN, EXP_A_TX_6_DP, EXP_A_TX_7_DN, EXP_A_TX_7_DP, EXP_A_TX_8_DN, EXP_A_TX_8_DP, EXP_A_TX_9_DN, EXP_A_TX_9_DP, EXP_A_TX_10_DN, EXP_A_TX_10_DP, EXP_A_TX_11_DN, EXP_A_TX_11_DP, EXP_A_TX_12_DN, EXP_A_TX_12_DP, EXP_A_TX_13_DN, EXP_A_TX_13_DP, EXP_A_TX_14_DN, EXP_A_TX_14_DP, EXP_A_TX_15_DN, EXP_A_TX_15_DP, EXP_A_TX_16_DN, EXP_A_TX_16_DP, EXP_A_TX_17_DN, EXP_A_TX_17_DP, EXP_A_TX_18_DN, EXP_A_TX_18_DP, EXP_A_TX_19_DN, EXP_A_TX_19_DP

### Nets
EXP_A_RX_4_DP: U1401.B10(PCIE_X16_RXP_5) U1401.B12(PCIE_X16_RXP_4) ; port EXP_A_RX_5_DP, port EXP_A_RX_4_DP  [also labelled EXP_A_RX_5_DP]
DMI_IT_MR_0_DN: R?#31.1 ; port DMI_IT_MR_0_DN
DMI_IT_MR_0_DP: R?#29.1 ; port DMI_IT_MR_0_DP
DMI_IT_MR_0_R_DN: R?#31.2 U1401.AK8(DMI_RXN_0)
DMI_IT_MR_0_R_DP: R?#29.2 U1401.AK7(DMI_RXP_0)
DMI_IT_MR_1_DN: R?#27.1 ; port DMI_IT_MR_1_DN
DMI_IT_MR_1_DP: R?#25.1 ; port DMI_IT_MR_1_DP
DMI_IT_MR_1_R_DN: R?#27.2 U1401.AJ7(DMI_RXN_1)
DMI_IT_MR_1_R_DP: R?#25.2 U1401.AJ6(DMI_RXP_1)
DMI_IT_MR_2_DN: R?#23.1 ; port DMI_IT_MR_2_DN
DMI_IT_MR_2_DP: R?#21.1 ; port DMI_IT_MR_2_DP
DMI_IT_MR_2_R_DN: R?#23.2 U1401.AH8(DMI_RXN_2)
DMI_IT_MR_2_R_DP: R?#21.2 U1401.AH7(DMI_RXP_2)
DMI_IT_MR_3_DN: R?#19.1 ; port DMI_IT_MR_3_DN
DMI_IT_MR_3_DP: R?#17.1 ; port DMI_IT_MR_3_DP
DMI_IT_MR_3_R_DN: R?#19.2 U1401.AG7(DMI_RXN_3)
DMI_IT_MR_3_R_DP: R?#17.2 U1401.AG6(DMI_RXP_3)
DMI_IT_MR_4_DN: R?#15.1 ; port DMI_IT_MR_4_DN
DMI_IT_MR_4_DP: R?#13.1 ; port DMI_IT_MR_4_DP
DMI_IT_MR_4_R_DN: R?#15.2 U1401.AF8(DMI_RXN_4)
DMI_IT_MR_4_R_DP: R?#13.2 U1401.AF7(DMI_RXP_4)
DMI_IT_MR_5_DN: R?#11.1 ; port DMI_IT_MR_5_DN
DMI_IT_MR_5_DP: R?#9.1 ; port DMI_IT_MR_5_DP
DMI_IT_MR_5_R_DN: R?#11.2 U1401.AE7(DMI_RXN_5)
DMI_IT_MR_5_R_DP: R?#9.2 U1401.AE6(DMI_RXP_5)
DMI_IT_MR_6_DN: R?#7.1 ; port DMI_IT_MR_6_DN
DMI_IT_MR_6_DP: R?#5.1 ; port DMI_IT_MR_6_DP
DMI_IT_MR_6_R_DN: R?#7.2 U1401.AD8(DMI_RXN_6)
DMI_IT_MR_6_R_DP: R?#5.2 U1401.AD7(DMI_RXP_6)
DMI_IT_MR_7_DN: R?#3.1 ; port DMI_IT_MR_7_DN
DMI_IT_MR_7_DP: R?#1.1 ; port DMI_IT_MR_7_DP
DMI_IT_MR_7_R_DN: R?#3.2 U1401.AC7(DMI_RXN_7)
DMI_IT_MR_7_R_DP: R?#1.2 U1401.AC6(DMI_RXP_7)
DMI_MT_IR_0_DN: R?#32.2 ; port DMI_MT_IR_0_DN
DMI_MT_IR_0_DP: R?#30.2 ; port DMI_MT_IR_0_DP
DMI_MT_IR_0_R_DN: R?#32.1 U1401.AJ4(DMI_TXN_0)
DMI_MT_IR_0_R_DP: R?#30.1 U1401.AJ3(DMI_TXP_0)
DMI_MT_IR_1_DN: R?#28.2 ; port DMI_MT_IR_1_DN
DMI_MT_IR_1_DP: R?#26.2 ; port DMI_MT_IR_1_DP
DMI_MT_IR_1_R_DN: R?#28.1 U1401.AH2(DMI_TXN_1)
DMI_MT_IR_1_R_DP: R?#26.1 U1401.AH1(DMI_TXP_1)
DMI_MT_IR_2_DN: R?#24.2 ; port DMI_MT_IR_2_DN
DMI_MT_IR_2_DP: R?#22.2 ; port DMI_MT_IR_2_DP
DMI_MT_IR_2_R_DN: R?#24.1 U1401.AG4(DMI_TXN_2)
DMI_MT_IR_2_R_DP: R?#22.1 U1401.AG3(DMI_TXP_2)
DMI_MT_IR_3_DN: R?#20.2 ; port DMI_MT_IR_3_DN
DMI_MT_IR_3_DP: R?#18.2 ; port DMI_MT_IR_3_DP
DMI_MT_IR_3_R_DN: R?#20.1 U1401.AF2(DMI_TXN_3)
DMI_MT_IR_3_R_DP: R?#18.1 U1401.AF1(DMI_TXP_3)
DMI_MT_IR_4_DN: R?#16.2 ; port DMI_MT_IR_4_DN
DMI_MT_IR_4_DP: R?#14.2 ; port DMI_MT_IR_4_DP
DMI_MT_IR_4_R_DN: R?#16.1 U1401.AE4(DMI_TXN_4)
DMI_MT_IR_4_R_DP: R?#14.1 U1401.AE3(DMI_TXP_4)
DMI_MT_IR_5_DN: R?#12.2 ; port DMI_MT_IR_5_DN
DMI_MT_IR_5_DP: R?#10.2 ; port DMI_MT_IR_5_DP
DMI_MT_IR_5_R_DN: R?#12.1 U1401.AD2(DMI_TXN_5)
DMI_MT_IR_5_R_DP: R?#10.1 U1401.AD1(DMI_TXP_5)
DMI_MT_IR_6_DN: R?#8.2 ; port DMI_MT_IR_6_DN
DMI_MT_IR_6_DP: R?#6.2 ; port DMI_MT_IR_6_DP
DMI_MT_IR_6_R_DN: R?#8.1 U1401.AC4(DMI_TXN_6)
DMI_MT_IR_6_R_DP: R?#6.1 U1401.AC3(DMI_TXP_6)
DMI_MT_IR_7_DN: R?#4.2 ; port DMI_MT_IR_7_DN
DMI_MT_IR_7_DP: R?#2.2 ; port DMI_MT_IR_7_DP
DMI_MT_IR_7_R_DN: R?#4.1 U1401.AB2(DMI_TXN_7)
DMI_MT_IR_7_R_DP: R?#2.1 U1401.AB1(DMI_TXP_7)
EXP_A_RX_0_DN: U1401.C20(PCIE_X16_RXN_0) ; port EXP_A_RX_0_DN
EXP_A_RX_0_DP: U1401.B20(PCIE_X16_RXP_0) ; port EXP_A_RX_0_DP
EXP_A_RX_1_DN: U1401.C18(PCIE_X16_RXN_1) ; port EXP_A_RX_1_DN
EXP_A_RX_1_DP: U1401.B18(PCIE_X16_RXP_1) ; port EXP_A_RX_1_DP
EXP_A_RX_2_DN: U1401.C16(PCIE_X16_RXN_2) ; port EXP_A_RX_2_DN
EXP_A_RX_2_DP: U1401.B16(PCIE_X16_RXP_2) ; port EXP_A_RX_2_DP
EXP_A_RX_3_DN: U1401.C14(PCIE_X16_RXN_3) ; port EXP_A_RX_3_DN
EXP_A_RX_3_DP: U1401.B14(PCIE_X16_RXP_3) ; port EXP_A_RX_3_DP
EXP_A_RX_4_DN: U1401.C12(PCIE_X16_RXN_4) ; port EXP_A_RX_4_DN
EXP_A_RX_5_DN: U1401.C10(PCIE_X16_RXN_5) ; port EXP_A_RX_5_DN
EXP_A_RX_6_DN: U1401.C8(PCIE_X16_RXN_6) ; port EXP_A_RX_6_DN
EXP_A_RX_6_DP: U1401.B8(PCIE_X16_RXP_6) ; port EXP_A_RX_6_DP
EXP_A_RX_7_DN: U1401.D3(PCIE_X16_RXN_7) ; port EXP_A_RX_7_DN
EXP_A_RX_7_DP: U1401.D2(PCIE_X16_RXP_7) ; port EXP_A_RX_7_DP
EXP_A_RX_8_DN: U1401.F3(PCIE_X16_RXN_8) ; port EXP_A_RX_8_DN
EXP_A_RX_8_DP: U1401.F2(PCIE_X16_RXP_8) ; port EXP_A_RX_8_DP
EXP_A_RX_9_DN: U1401.H3(PCIE_X16_RXN_9) ; port EXP_A_RX_9_DN
EXP_A_RX_9_DP: U1401.H2(PCIE_X16_RXP_9) ; port EXP_A_RX_9_DP
EXP_A_RX_10_DN: U1401.K3(PCIE_X16_RXN_10) ; port EXP_A_RX_10_DN
EXP_A_RX_10_DP: U1401.K2(PCIE_X16_RXP_10) ; port EXP_A_RX_10_DP
EXP_A_RX_11_DN: U1401.M3(PCIE_X16_RXN_11) ; port EXP_A_RX_11_DN
EXP_A_RX_11_DP: U1401.M2(PCIE_X16_RXP_11) ; port EXP_A_RX_11_DP
EXP_A_RX_12_DN: U1401.P3(PCIE_X16_RXN_12) ; port EXP_A_RX_12_DN
EXP_A_RX_12_DP: U1401.P2(PCIE_X16_RXP_12) ; port EXP_A_RX_12_DP
EXP_A_RX_13_DN: U1401.T3(PCIE_X16_RXN_13) ; port EXP_A_RX_13_DN
EXP_A_RX_13_DP: U1401.T2(PCIE_X16_RXP_13) ; port EXP_A_RX_13_DP
EXP_A_RX_14_DN: U1401.V3(PCIE_X16_RXN_14) ; port EXP_A_RX_14_DN
EXP_A_RX_14_DP: U1401.V2(PCIE_X16_RXP_14) ; port EXP_A_RX_14_DP
EXP_A_RX_15_DN: U1401.Y3(PCIE_X16_RXN_15) ; port EXP_A_RX_15_DN
EXP_A_RX_15_DP: U1401.Y2(PCIE_X16_RXP_15) ; port EXP_A_RX_15_DP
EXP_A_RX_16_DN: U1401.C28(PCIE_X4_RXN_0) ; port EXP_A_RX_16_DN
EXP_A_RX_16_DP: U1401.B28(PCIE_X4_RXP_0) ; port EXP_A_RX_16_DP
EXP_A_RX_17_DN: U1401.C26(PCIE_X4_RXN_1) ; port EXP_A_RX_17_DN
EXP_A_RX_17_DP: U1401.B26(PCIE_X4_RXP_1) ; port EXP_A_RX_17_DP
EXP_A_RX_18_DN: U1401.C24(PCIE_X4_RXN_2) ; port EXP_A_RX_18_DN
EXP_A_RX_18_DP: U1401.B24(PCIE_X4_RXP_2) ; port EXP_A_RX_18_DP
EXP_A_RX_19_DN: U1401.C22(PCIE_X4_RXN_3) ; port EXP_A_RX_19_DN
EXP_A_RX_19_DP: U1401.B22(PCIE_X4_RXP_3) ; port EXP_A_RX_19_DP
EXP_A_TX_0_DN: U1401.F21(PCIE_X16_TXN_0) ; port EXP_A_TX_0_DN
EXP_A_TX_0_DP: U1401.E21(PCIE_X16_TXP_0) ; port EXP_A_TX_0_DP
EXP_A_TX_1_DN: U1401.F19(PCIE_X16_TXN_1) ; port EXP_A_TX_1_DN
EXP_A_TX_1_DP: U1401.E19(PCIE_X16_TXP_1) ; port EXP_A_TX_1_DP
EXP_A_TX_2_DN: U1401.F17(PCIE_X16_TXN_2) ; port EXP_A_TX_2_DN
EXP_A_TX_2_DP: U1401.E17(PCIE_X16_TXP_2) ; port EXP_A_TX_2_DP
EXP_A_TX_3_DN: U1401.F15(PCIE_X16_TXN_3) ; port EXP_A_TX_3_DN
EXP_A_TX_3_DP: U1401.E15(PCIE_X16_TXP_3) ; port EXP_A_TX_3_DP
EXP_A_TX_4_DN: U1401.F13(PCIE_X16_TXN_4) ; port EXP_A_TX_4_DN
EXP_A_TX_4_DP: U1401.E13(PCIE_X16_TXP_4) ; port EXP_A_TX_4_DP
EXP_A_TX_5_DN: U1401.F11(PCIE_X16_TXN_5) ; port EXP_A_TX_5_DN
EXP_A_TX_5_DP: U1401.E11(PCIE_X16_TXP_5) ; port EXP_A_TX_5_DP
EXP_A_TX_6_DN: U1401.F9(PCIE_X16_TXN_6) ; port EXP_A_TX_6_DN
EXP_A_TX_6_DP: U1401.E9(PCIE_X16_TXP_6) ; port EXP_A_TX_6_DP
EXP_A_TX_7_DN: U1401.E7(PCIE_X16_TXN_7) ; port EXP_A_TX_7_DN
EXP_A_TX_7_DP: U1401.E6(PCIE_X16_TXP_7) ; port EXP_A_TX_7_DP
EXP_A_TX_8_DN: U1401.G6(PCIE_X16_TXN_8) ; port EXP_A_TX_8_DN
EXP_A_TX_8_DP: U1401.G5(PCIE_X16_TXP_8) ; port EXP_A_TX_8_DP
EXP_A_TX_9_DN: U1401.J6(PCIE_X16_TXN_9) ; port EXP_A_TX_9_DN
EXP_A_TX_9_DP: U1401.J5(PCIE_X16_TXP_9) ; port EXP_A_TX_9_DP
EXP_A_TX_10_DN: U1401.L6(PCIE_X16_TXN_10) ; port EXP_A_TX_10_DN
EXP_A_TX_10_DP: U1401.L5(PCIE_X16_TXP_10) ; port EXP_A_TX_10_DP
EXP_A_TX_11_DN: U1401.N6(PCIE_X16_TXN_11) ; port EXP_A_TX_11_DN
EXP_A_TX_11_DP: U1401.N5(PCIE_X16_TXP_11) ; port EXP_A_TX_11_DP
EXP_A_TX_12_DN: U1401.R6(PCIE_X16_TXN_12) ; port EXP_A_TX_12_DN
EXP_A_TX_12_DP: U1401.R5(PCIE_X16_TXP_12) ; port EXP_A_TX_12_DP
EXP_A_TX_13_DN: U1401.U6(PCIE_X16_TXN_13) ; port EXP_A_TX_13_DN
EXP_A_TX_13_DP: U1401.U5(PCIE_X16_TXP_13) ; port EXP_A_TX_13_DP
EXP_A_TX_14_DN: U1401.W6(PCIE_X16_TXN_14) ; port EXP_A_TX_14_DN
EXP_A_TX_14_DP: U1401.W5(PCIE_X16_TXP_14) ; port EXP_A_TX_14_DP
EXP_A_TX_15_DN: U1401.AA6(PCIE_X16_TXN_15) ; port EXP_A_TX_15_DN
EXP_A_TX_15_DP: U1401.AA5(PCIE_X16_TXP_15) ; port EXP_A_TX_15_DP
EXP_A_TX_16_DN: U1401.F29(PCIE_X4_TXN_0) ; port EXP_A_TX_16_DN
EXP_A_TX_16_DP: U1401.E29(PCIE_X4_TXP_0) ; port EXP_A_TX_16_DP
EXP_A_TX_17_DN: U1401.F27(PCIE_X4_TXN_1) ; port EXP_A_TX_17_DN
EXP_A_TX_17_DP: U1401.E27(PCIE_X4_TXP_1) ; port EXP_A_TX_17_DP
EXP_A_TX_18_DN: U1401.F25(PCIE_X4_TXN_2) ; port EXP_A_TX_18_DN
EXP_A_TX_18_DP: U1401.E25(PCIE_X4_TXP_2) ; port EXP_A_TX_18_DP
EXP_A_TX_19_DN: U1401.F23(PCIE_X4_TXN_3) ; port EXP_A_TX_19_DN
EXP_A_TX_19_DP: U1401.E23(PCIE_X4_TXP_3) ; port EXP_A_TX_19_DP

### Notes on the sheet
- (in symbol C_RPL_HX_EXT, part C) 3 OF 19

### Library data of the parts
R?#1-R?#32 = Res: Thick Film Resistor -  0ohm, 1%, 0201

## Sheet 0013_Processor - DISPLA.SchDoc
size A3
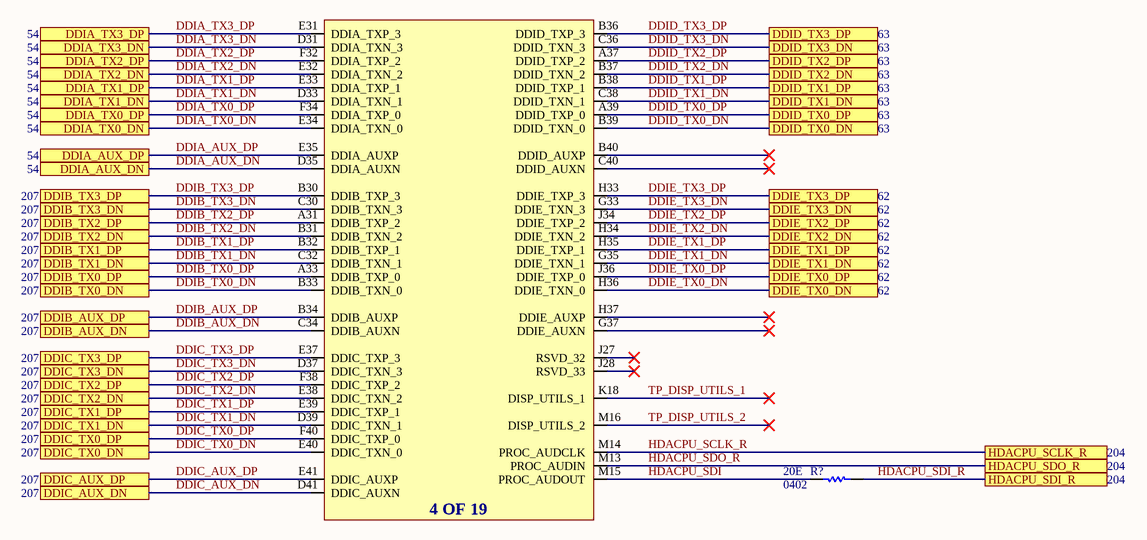
[diagram p37: 0013_Processor - DISPLA.SchDoc]

### Parts
(Parts that share a designator on the sheet are numbered #1, #2 ... from top to bottom, then left to right.)
R?#33  value 20E  Case/Package: 0402  [RESC0402]  (hidden comment: Res)
U1401  C_RPL_HX_EXT  (value not drawn)  (part D of 19)

### Ports
DDIA_AUX_DN, DDIA_AUX_DP, DDIA_TX0_DN, DDIA_TX0_DP, DDIA_TX1_DN, DDIA_TX1_DP, DDIA_TX2_DN, DDIA_TX2_DP, DDIA_TX3_DN, DDIA_TX3_DP, DDIB_AUX_DN, DDIB_AUX_DP, DDIB_TX0_DN, DDIB_TX0_DP, DDIB_TX1_DN, DDIB_TX1_DP, DDIB_TX2_DN, DDIB_TX2_DP, DDIB_TX3_DN, DDIB_TX3_DP, DDIC_AUX_DN, DDIC_AUX_DP, DDIC_TX0_DN, DDIC_TX0_DP, DDIC_TX1_DN, DDIC_TX1_DP, DDIC_TX2_DN, DDIC_TX2_DP, DDIC_TX3_DN, DDIC_TX3_DP, DDID_TX0_DN, DDID_TX0_DP, DDID_TX1_DN, DDID_TX1_DP, DDID_TX2_DN, DDID_TX2_DP, DDID_TX3_DN, DDID_TX3_DP, DDIE_TX0_DN, DDIE_TX0_DP, DDIE_TX1_DN, DDIE_TX1_DP, DDIE_TX2_DN, DDIE_TX2_DP, DDIE_TX3_DN, DDIE_TX3_DP, HDACPU_SCLK_R, HDACPU_SDI_R, HDACPU_SDO_R

### Nets
DDIA_AUX_DN: U1401.D35(DDIA_AUXN) ; port DDIA_AUX_DN
DDIA_AUX_DP: U1401.E35(DDIA_AUXP) ; port DDIA_AUX_DP
DDIA_TX0_DN: U1401.E34(DDIA_TXN_0) ; port DDIA_TX0_DN
DDIA_TX0_DP: U1401.F34(DDIA_TXP_0) ; port DDIA_TX0_DP
DDIA_TX1_DN: U1401.D33(DDIA_TXN_1) ; port DDIA_TX1_DN
DDIA_TX1_DP: U1401.E33(DDIA_TXP_1) ; port DDIA_TX1_DP
DDIA_TX2_DN: U1401.E32(DDIA_TXN_2) ; port DDIA_TX2_DN
DDIA_TX2_DP: U1401.F32(DDIA_TXP_2) ; port DDIA_TX2_DP
DDIA_TX3_DN: U1401.D31(DDIA_TXN_3) ; port DDIA_TX3_DN
DDIA_TX3_DP: U1401.E31(DDIA_TXP_3) ; port DDIA_TX3_DP
DDIB_AUX_DN: U1401.C34(DDIB_AUXN) ; port DDIB_AUX_DN
DDIB_AUX_DP: U1401.B34(DDIB_AUXP) ; port DDIB_AUX_DP
DDIB_TX0_DN: U1401.B33(DDIB_TXN_0) ; port DDIB_TX0_DN
DDIB_TX0_DP: U1401.A33(DDIB_TXP_0) ; port DDIB_TX0_DP
DDIB_TX1_DN: U1401.C32(DDIB_TXN_1) ; port DDIB_TX1_DN
DDIB_TX1_DP: U1401.B32(DDIB_TXP_1) ; port DDIB_TX1_DP
DDIB_TX2_DN: U1401.B31(DDIB_TXN_2) ; port DDIB_TX2_DN
DDIB_TX2_DP: U1401.A31(DDIB_TXP_2) ; port DDIB_TX2_DP
DDIB_TX3_DN: U1401.C30(DDIB_TXN_3) ; port DDIB_TX3_DN
DDIB_TX3_DP: U1401.B30(DDIB_TXP_3) ; port DDIB_TX3_DP
DDIC_AUX_DN: U1401.D41(DDIC_AUXN) ; port DDIC_AUX_DN
DDIC_AUX_DP: U1401.E41(DDIC_AUXP) ; port DDIC_AUX_DP
DDIC_TX0_DN: U1401.E40(DDIC_TXN_0) ; port DDIC_TX0_DN
DDIC_TX0_DP: U1401.F40(DDIC_TXP_0) ; port DDIC_TX0_DP
DDIC_TX1_DN: U1401.D39(DDIC_TXN_1) ; port DDIC_TX1_DN
DDIC_TX1_DP: U1401.E39(DDIC_TXP_1) ; port DDIC_TX1_DP
DDIC_TX2_DN: U1401.E38(DDIC_TXN_2) ; port DDIC_TX2_DN
DDIC_TX2_DP: U1401.F38(DDIC_TXP_2) ; port DDIC_TX2_DP
DDIC_TX3_DN: U1401.D37(DDIC_TXN_3) ; port DDIC_TX3_DN
DDIC_TX3_DP: U1401.E37(DDIC_TXP_3) ; port DDIC_TX3_DP
DDID_TX0_DN: U1401.B39(DDID_TXN_0) ; port DDID_TX0_DN
DDID_TX0_DP: U1401.A39(DDID_TXP_0) ; port DDID_TX0_DP
DDID_TX1_DN: U1401.C38(DDID_TXN_1) ; port DDID_TX1_DN
DDID_TX1_DP: U1401.B38(DDID_TXP_1) ; port DDID_TX1_DP
DDID_TX2_DN: U1401.B37(DDID_TXN_2) ; port DDID_TX2_DN
DDID_TX2_DP: U1401.A37(DDID_TXP_2) ; port DDID_TX2_DP
DDID_TX3_DN: U1401.C36(DDID_TXN_3) ; port DDID_TX3_DN
DDID_TX3_DP: U1401.B36(DDID_TXP_3) ; port DDID_TX3_DP
DDIE_TX0_DN: U1401.H36(DDIE_TXN_0) ; port DDIE_TX0_DN
DDIE_TX0_DP: U1401.J36(DDIE_TXP_0) ; port DDIE_TX0_DP
DDIE_TX1_DN: U1401.G35(DDIE_TXN_1) ; port DDIE_TX1_DN
DDIE_TX1_DP: U1401.H35(DDIE_TXP_1) ; port DDIE_TX1_DP
DDIE_TX2_DN: U1401.H34(DDIE_TXN_2) ; port DDIE_TX2_DN
DDIE_TX2_DP: U1401.J34(DDIE_TXP_2) ; port DDIE_TX2_DP
DDIE_TX3_DN: U1401.G33(DDIE_TXN_3) ; port DDIE_TX3_DN
DDIE_TX3_DP: U1401.H33(DDIE_TXP_3) ; port DDIE_TX3_DP
HDACPU_SCLK_R: U1401.M14(PROC_AUDCLK) ; port HDACPU_SCLK_R
HDACPU_SDI: R?#33.1 U1401.M15(PROC_AUDOUT)
HDACPU_SDI_R: R?#33.2 ; port HDACPU_SDI_R
HDACPU_SDO_R: U1401.M13(PROC_AUDIN) ; port HDACPU_SDO_R
TP_DISP_UTILS_1: U1401.K18(DISP_UTILS_1)
TP_DISP_UTILS_2: U1401.M16(DISP_UTILS_2)

Not connected (* = marked no-connect by the designer): U1401 B40(DDID_AUXP)* C40(DDID_AUXN)* G37(DDIE_AUXN)* H37(DDIE_AUXP)* J27(RSVD_32)* J28(RSVD_33)*

### Notes on the sheet
- (in symbol C_RPL_HX_EXT, part D) 4 OF 19

### Library data of the parts
R?#33 = Res: Thick Film Resistor -  20ohm, 1%, 0402

## Sheet 0014_Processor - MEMORY.SchDoc
size A3
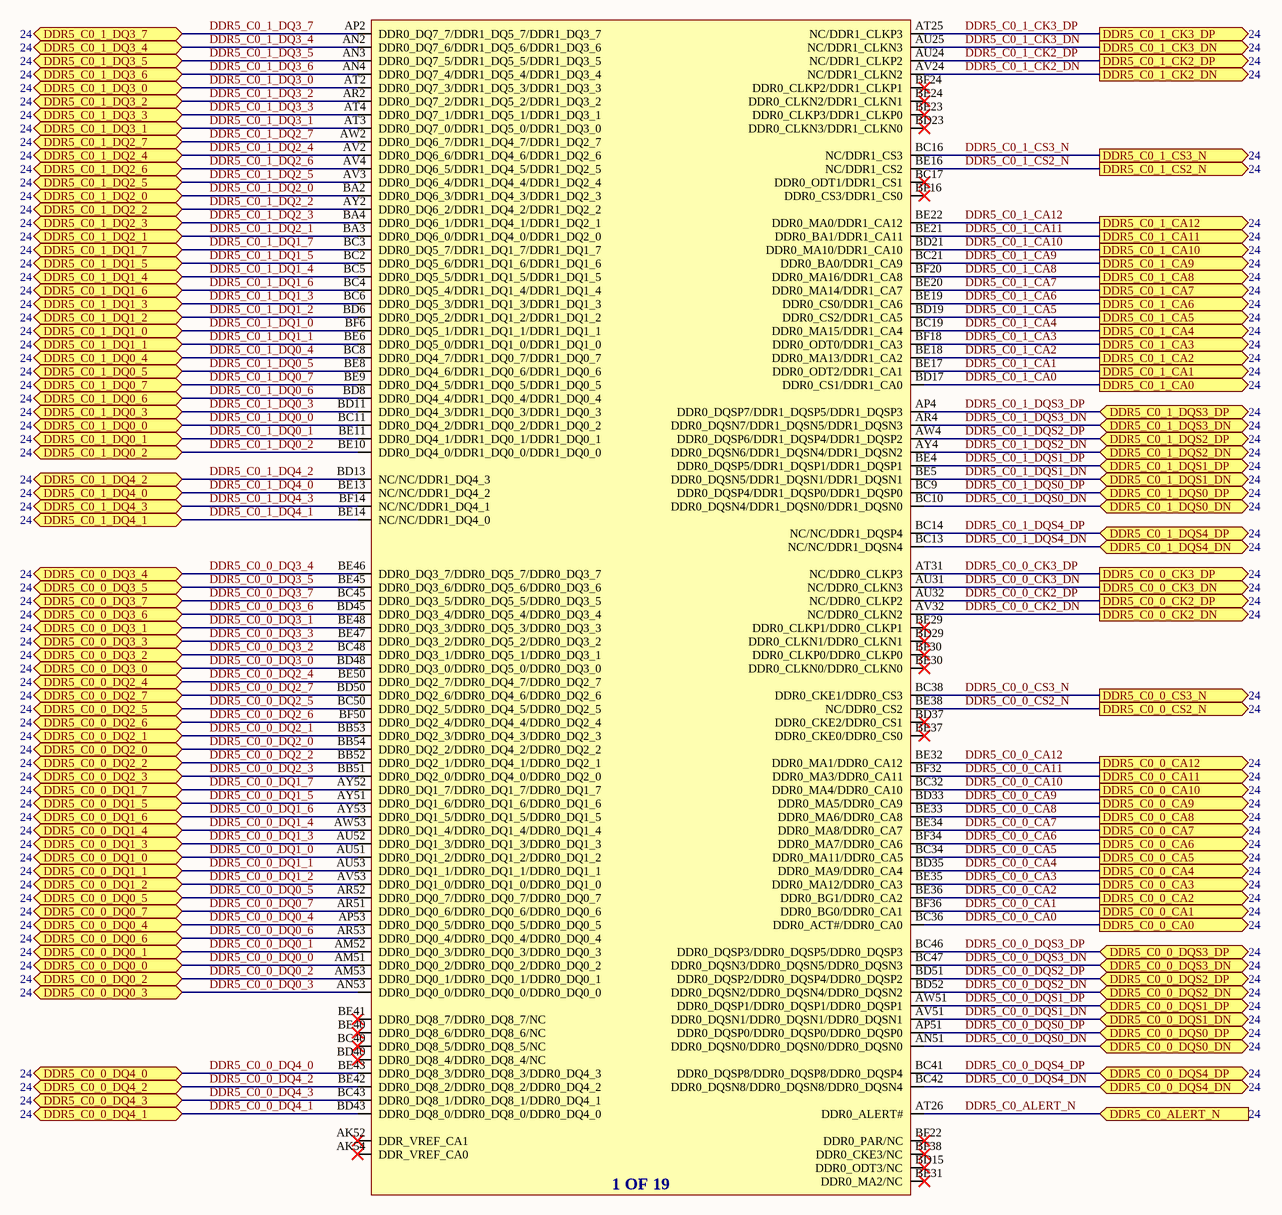
[diagram p38: 0014_Processor - MEMORY.SchDoc]

### Parts
U1401  C_RPL_HX_EXT  (value not drawn)  (part A of 19)

### Ports
DDR5_C0_0_CA0 (out), DDR5_C0_0_CA1 (out), DDR5_C0_0_CA2 (out), DDR5_C0_0_CA3 (out), DDR5_C0_0_CA4 (out), DDR5_C0_0_CA5 (out), DDR5_C0_0_CA6 (out), DDR5_C0_0_CA7 (out), DDR5_C0_0_CA8 (out), DDR5_C0_0_CA9 (out), DDR5_C0_0_CA10 (out), DDR5_C0_0_CA11 (out), DDR5_C0_0_CA12 (out), DDR5_C0_0_CK2_DN (out), DDR5_C0_0_CK2_DP (out), DDR5_C0_0_CK3_DN (out), DDR5_C0_0_CK3_DP (out), DDR5_C0_0_CS2_N (out), DDR5_C0_0_CS3_N (out), DDR5_C0_0_DQ0_0 (bidir), DDR5_C0_0_DQ0_1 (bidir), DDR5_C0_0_DQ0_2 (bidir), DDR5_C0_0_DQ0_3 (bidir), DDR5_C0_0_DQ0_4 (bidir), DDR5_C0_0_DQ0_5 (bidir), DDR5_C0_0_DQ0_6 (bidir), DDR5_C0_0_DQ0_7 (bidir), DDR5_C0_0_DQ1_0 (bidir), DDR5_C0_0_DQ1_1 (bidir), DDR5_C0_0_DQ1_2 (bidir), DDR5_C0_0_DQ1_3 (bidir), DDR5_C0_0_DQ1_4 (bidir), DDR5_C0_0_DQ1_5 (bidir), DDR5_C0_0_DQ1_6 (bidir), DDR5_C0_0_DQ1_7 (bidir), DDR5_C0_0_DQ2_0 (bidir), DDR5_C0_0_DQ2_1 (bidir), DDR5_C0_0_DQ2_2 (bidir), DDR5_C0_0_DQ2_3 (bidir), DDR5_C0_0_DQ2_4 (bidir), DDR5_C0_0_DQ2_5 (bidir), DDR5_C0_0_DQ2_6 (bidir), DDR5_C0_0_DQ2_7 (bidir), DDR5_C0_0_DQ3_0 (bidir), DDR5_C0_0_DQ3_1 (bidir), DDR5_C0_0_DQ3_2 (bidir), DDR5_C0_0_DQ3_3 (bidir), DDR5_C0_0_DQ3_4 (bidir), DDR5_C0_0_DQ3_5 (bidir), DDR5_C0_0_DQ3_6 (bidir), DDR5_C0_0_DQ3_7 (bidir), DDR5_C0_0_DQ4_0 (bidir), DDR5_C0_0_DQ4_1 (bidir), DDR5_C0_0_DQ4_2 (bidir), DDR5_C0_0_DQ4_3 (bidir), DDR5_C0_0_DQS0_DN (bidir), DDR5_C0_0_DQS0_DP (bidir), DDR5_C0_0_DQS1_DN (bidir), DDR5_C0_0_DQS1_DP (bidir), DDR5_C0_0_DQS2_DN (bidir), DDR5_C0_0_DQS2_DP (bidir), DDR5_C0_0_DQS3_DN (bidir), DDR5_C0_0_DQS3_DP (bidir), DDR5_C0_0_DQS4_DN (bidir), DDR5_C0_0_DQS4_DP (bidir), DDR5_C0_1_CA0 (out), DDR5_C0_1_CA1 (out), DDR5_C0_1_CA2 (out), DDR5_C0_1_CA3 (out), DDR5_C0_1_CA4 (out), DDR5_C0_1_CA5 (out), DDR5_C0_1_CA6 (out), DDR5_C0_1_CA7 (out), DDR5_C0_1_CA8 (out), DDR5_C0_1_CA9 (out), DDR5_C0_1_CA10 (out), DDR5_C0_1_CA11 (out), DDR5_C0_1_CA12 (out), DDR5_C0_1_CK2_DN (out), DDR5_C0_1_CK2_DP (out), DDR5_C0_1_CK3_DN (out), DDR5_C0_1_CK3_DP (out), DDR5_C0_1_CS2_N (out), DDR5_C0_1_CS3_N (out), DDR5_C0_1_DQ0_0 (bidir), DDR5_C0_1_DQ0_1 (bidir), DDR5_C0_1_DQ0_2 (bidir), DDR5_C0_1_DQ0_3 (bidir), DDR5_C0_1_DQ0_4 (bidir), DDR5_C0_1_DQ0_5 (bidir), DDR5_C0_1_DQ0_6 (bidir), DDR5_C0_1_DQ0_7 (bidir), DDR5_C0_1_DQ1_0 (bidir), DDR5_C0_1_DQ1_1 (bidir), DDR5_C0_1_DQ1_2 (bidir), DDR5_C0_1_DQ1_3 (bidir), DDR5_C0_1_DQ1_4 (bidir), DDR5_C0_1_DQ1_5 (bidir), DDR5_C0_1_DQ1_6 (bidir), DDR5_C0_1_DQ1_7 (bidir), DDR5_C0_1_DQ2_0 (bidir), DDR5_C0_1_DQ2_1 (bidir), DDR5_C0_1_DQ2_2 (bidir), DDR5_C0_1_DQ2_3 (bidir), DDR5_C0_1_DQ2_4 (bidir), DDR5_C0_1_DQ2_5 (bidir), DDR5_C0_1_DQ2_6 (bidir), DDR5_C0_1_DQ2_7 (bidir), DDR5_C0_1_DQ3_0 (bidir), DDR5_C0_1_DQ3_1 (bidir), DDR5_C0_1_DQ3_2 (bidir), DDR5_C0_1_DQ3_3 (bidir), DDR5_C0_1_DQ3_4 (bidir), DDR5_C0_1_DQ3_5 (bidir), DDR5_C0_1_DQ3_6 (bidir), DDR5_C0_1_DQ3_7 (bidir), DDR5_C0_1_DQ4_0 (bidir), DDR5_C0_1_DQ4_1 (bidir), DDR5_C0_1_DQ4_2 (bidir), DDR5_C0_1_DQ4_3 (bidir), DDR5_C0_1_DQS0_DN (bidir), DDR5_C0_1_DQS0_DP (bidir), DDR5_C0_1_DQS1_DN (bidir), DDR5_C0_1_DQS1_DP (bidir), DDR5_C0_1_DQS2_DN (bidir), DDR5_C0_1_DQS2_DP (bidir), DDR5_C0_1_DQS3_DN (bidir), DDR5_C0_1_DQS3_DP (bidir), DDR5_C0_1_DQS4_DN (bidir), DDR5_C0_1_DQS4_DP (bidir), DDR5_C0_ALERT_N (in)

### Nets
DDR5_C0_0_CA0: U1401.BC36(DDR0_ACT#/DDR0_CA0) ; port DDR5_C0_0_CA0
DDR5_C0_0_CA1: U1401.BF36(DDR0_BG0/DDR0_CA1) ; port DDR5_C0_0_CA1
DDR5_C0_0_CA2: U1401.BE36(DDR0_BG1/DDR0_CA2) ; port DDR5_C0_0_CA2
DDR5_C0_0_CA3: U1401.BE35(DDR0_MA12/DDR0_CA3) ; port DDR5_C0_0_CA3
DDR5_C0_0_CA4: U1401.BD35(DDR0_MA9/DDR0_CA4) ; port DDR5_C0_0_CA4
DDR5_C0_0_CA5: U1401.BC34(DDR0_MA11/DDR0_CA5) ; port DDR5_C0_0_CA5
DDR5_C0_0_CA6: U1401.BF34(DDR0_MA7/DDR0_CA6) ; port DDR5_C0_0_CA6
DDR5_C0_0_CA7: U1401.BE34(DDR0_MA8/DDR0_CA7) ; port DDR5_C0_0_CA7
DDR5_C0_0_CA8: U1401.BE33(DDR0_MA6/DDR0_CA8) ; port DDR5_C0_0_CA8
DDR5_C0_0_CA9: U1401.BD33(DDR0_MA5/DDR0_CA9) ; port DDR5_C0_0_CA9
DDR5_C0_0_CA10: U1401.BC32(DDR0_MA4/DDR0_CA10) ; port DDR5_C0_0_CA10
DDR5_C0_0_CA11: U1401.BF32(DDR0_MA3/DDR0_CA11) ; port DDR5_C0_0_CA11
DDR5_C0_0_CA12: U1401.BE32(DDR0_MA1/DDR0_CA12) ; port DDR5_C0_0_CA12
DDR5_C0_0_CK2_DN: U1401.AV32(NC/DDR0_CLKN2) ; port DDR5_C0_0_CK2_DN
DDR5_C0_0_CK2_DP: U1401.AU32(NC/DDR0_CLKP2) ; port DDR5_C0_0_CK2_DP
DDR5_C0_0_CK3_DN: U1401.AU31(NC/DDR0_CLKN3) ; port DDR5_C0_0_CK3_DN
DDR5_C0_0_CK3_DP: U1401.AT31(NC/DDR0_CLKP3) ; port DDR5_C0_0_CK3_DP
DDR5_C0_0_CS2_N: U1401.BE38(NC/DDR0_CS2) ; port DDR5_C0_0_CS2_N
DDR5_C0_0_CS3_N: U1401.BC38(DDR0_CKE1/DDR0_CS3) ; port DDR5_C0_0_CS3_N
DDR5_C0_0_DQ0_0: U1401.AM51(DDR0_DQ0_2/DDR0_DQ0_2/DDR0_DQ0_2) ; port DDR5_C0_0_DQ0_0
DDR5_C0_0_DQ0_1: U1401.AM52(DDR0_DQ0_3/DDR0_DQ0_3/DDR0_DQ0_3) ; port DDR5_C0_0_DQ0_1
DDR5_C0_0_DQ0_2: U1401.AM53(DDR0_DQ0_1/DDR0_DQ0_1/DDR0_DQ0_1) ; port DDR5_C0_0_DQ0_2
DDR5_C0_0_DQ0_3: U1401.AN53(DDR0_DQ0_0/DDR0_DQ0_0/DDR0_DQ0_0) ; port DDR5_C0_0_DQ0_3
DDR5_C0_0_DQ0_4: U1401.AP53(DDR0_DQ0_5/DDR0_DQ0_5/DDR0_DQ0_5) ; port DDR5_C0_0_DQ0_4
DDR5_C0_0_DQ0_5: U1401.AR52(DDR0_DQ0_7/DDR0_DQ0_7/DDR0_DQ0_7) ; port DDR5_C0_0_DQ0_5
DDR5_C0_0_DQ0_6: U1401.AR53(DDR0_DQ0_4/DDR0_DQ0_4/DDR0_DQ0_4) ; port DDR5_C0_0_DQ0_6
DDR5_C0_0_DQ0_7: U1401.AR51(DDR0_DQ0_6/DDR0_DQ0_6/DDR0_DQ0_6) ; port DDR5_C0_0_DQ0_7
DDR5_C0_0_DQ1_0: U1401.AU51(DDR0_DQ1_2/DDR0_DQ1_2/DDR0_DQ1_2) ; port DDR5_C0_0_DQ1_0
DDR5_C0_0_DQ1_1: U1401.AU53(DDR0_DQ1_1/DDR0_DQ1_1/DDR0_DQ1_1) ; port DDR5_C0_0_DQ1_1
DDR5_C0_0_DQ1_2: U1401.AV53(DDR0_DQ1_0/DDR0_DQ1_0/DDR0_DQ1_0) ; port DDR5_C0_0_DQ1_2
DDR5_C0_0_DQ1_3: U1401.AU52(DDR0_DQ1_3/DDR0_DQ1_3/DDR0_DQ1_3) ; port DDR5_C0_0_DQ1_3
DDR5_C0_0_DQ1_4: U1401.AW53(DDR0_DQ1_4/DDR0_DQ1_4/DDR0_DQ1_4) ; port DDR5_C0_0_DQ1_4
DDR5_C0_0_DQ1_5: U1401.AY51(DDR0_DQ1_6/DDR0_DQ1_6/DDR0_DQ1_6) ; port DDR5_C0_0_DQ1_5
DDR5_C0_0_DQ1_6: U1401.AY53(DDR0_DQ1_5/DDR0_DQ1_5/DDR0_DQ1_5) ; port DDR5_C0_0_DQ1_6
DDR5_C0_0_DQ1_7: U1401.AY52(DDR0_DQ1_7/DDR0_DQ1_7/DDR0_DQ1_7) ; port DDR5_C0_0_DQ1_7
DDR5_C0_0_DQ2_0: U1401.BB54(DDR0_DQ2_2/DDR0_DQ4_2/DDR0_DQ2_2) ; port DDR5_C0_0_DQ2_0
DDR5_C0_0_DQ2_1: U1401.BB53(DDR0_DQ2_3/DDR0_DQ4_3/DDR0_DQ2_3) ; port DDR5_C0_0_DQ2_1
DDR5_C0_0_DQ2_2: U1401.BB52(DDR0_DQ2_1/DDR0_DQ4_1/DDR0_DQ2_1) ; port DDR5_C0_0_DQ2_2
DDR5_C0_0_DQ2_3: U1401.BB51(DDR0_DQ2_0/DDR0_DQ4_0/DDR0_DQ2_0) ; port DDR5_C0_0_DQ2_3
DDR5_C0_0_DQ2_4: U1401.BE50(DDR0_DQ2_7/DDR0_DQ4_7/DDR0_DQ2_7) ; port DDR5_C0_0_DQ2_4
DDR5_C0_0_DQ2_5: U1401.BC50(DDR0_DQ2_5/DDR0_DQ4_5/DDR0_DQ2_5) ; port DDR5_C0_0_DQ2_5
DDR5_C0_0_DQ2_6: U1401.BF50(DDR0_DQ2_4/DDR0_DQ4_4/DDR0_DQ2_4) ; port DDR5_C0_0_DQ2_6
DDR5_C0_0_DQ2_7: U1401.BD50(DDR0_DQ2_6/DDR0_DQ4_6/DDR0_DQ2_6) ; port DDR5_C0_0_DQ2_7
DDR5_C0_0_DQ3_0: U1401.BD48(DDR0_DQ3_0/DDR0_DQ5_0/DDR0_DQ3_0) ; port DDR5_C0_0_DQ3_0
DDR5_C0_0_DQ3_1: U1401.BE48(DDR0_DQ3_3/DDR0_DQ5_3/DDR0_DQ3_3) ; port DDR5_C0_0_DQ3_1
DDR5_C0_0_DQ3_2: U1401.BC48(DDR0_DQ3_1/DDR0_DQ5_1/DDR0_DQ3_1) ; port DDR5_C0_0_DQ3_2
DDR5_C0_0_DQ3_3: U1401.BE47(DDR0_DQ3_2/DDR0_DQ5_2/DDR0_DQ3_2) ; port DDR5_C0_0_DQ3_3
DDR5_C0_0_DQ3_4: U1401.BE46(DDR0_DQ3_7/DDR0_DQ5_7/DDR0_DQ3_7) ; port DDR5_C0_0_DQ3_4
DDR5_C0_0_DQ3_5: U1401.BE45(DDR0_DQ3_6/DDR0_DQ5_6/DDR0_DQ3_6) ; port DDR5_C0_0_DQ3_5
DDR5_C0_0_DQ3_6: U1401.BD45(DDR0_DQ3_4/DDR0_DQ5_4/DDR0_DQ3_4) ; port DDR5_C0_0_DQ3_6
DDR5_C0_0_DQ3_7: U1401.BC45(DDR0_DQ3_5/DDR0_DQ5_5/DDR0_DQ3_5) ; port DDR5_C0_0_DQ3_7
DDR5_C0_0_DQ4_0: U1401.BE43(DDR0_DQ8_3/DDR0_DQ8_3/DDR0_DQ4_3) ; port DDR5_C0_0_DQ4_0
DDR5_C0_0_DQ4_1: U1401.BD43(DDR0_DQ8_0/DDR0_DQ8_0/DDR0_DQ4_0) ; port DDR5_C0_0_DQ4_1
DDR5_C0_0_DQ4_2: U1401.BE42(DDR0_DQ8_2/DDR0_DQ8_2/DDR0_DQ4_2) ; port DDR5_C0_0_DQ4_2
DDR5_C0_0_DQ4_3: U1401.BC43(DDR0_DQ8_1/DDR0_DQ8_1/DDR0_DQ4_1) ; port DDR5_C0_0_DQ4_3
DDR5_C0_0_DQS0_DN: U1401.AN51(DDR0_DQSN0/DDR0_DQSN0/DDR0_DQSN0) ; port DDR5_C0_0_DQS0_DN
DDR5_C0_0_DQS0_DP: U1401.AP51(DDR0_DQSP0/DDR0_DQSP0/DDR0_DQSP0) ; port DDR5_C0_0_DQS0_DP
DDR5_C0_0_DQS1_DN: U1401.AV51(DDR0_DQSN1/DDR0_DQSN1/DDR0_DQSN1) ; port DDR5_C0_0_DQS1_DN
DDR5_C0_0_DQS1_DP: U1401.AW51(DDR0_DQSP1/DDR0_DQSP1/DDR0_DQSP1) ; port DDR5_C0_0_DQS1_DP
DDR5_C0_0_DQS2_DN: U1401.BD52(DDR0_DQSN2/DDR0_DQSN4/DDR0_DQSN2) ; port DDR5_C0_0_DQS2_DN
DDR5_C0_0_DQS2_DP: U1401.BD51(DDR0_DQSP2/DDR0_DQSP4/DDR0_DQSP2) ; port DDR5_C0_0_DQS2_DP
DDR5_C0_0_DQS3_DN: U1401.BC47(DDR0_DQSN3/DDR0_DQSN5/DDR0_DQSN3) ; port DDR5_C0_0_DQS3_DN
DDR5_C0_0_DQS3_DP: U1401.BC46(DDR0_DQSP3/DDR0_DQSP5/DDR0_DQSP3) ; port DDR5_C0_0_DQS3_DP
DDR5_C0_0_DQS4_DN: U1401.BC42(DDR0_DQSN8/DDR0_DQSN8/DDR0_DQSN4) ; port DDR5_C0_0_DQS4_DN
DDR5_C0_0_DQS4_DP: U1401.BC41(DDR0_DQSP8/DDR0_DQSP8/DDR0_DQSP4) ; port DDR5_C0_0_DQS4_DP
DDR5_C0_1_CA0: U1401.BD17(DDR0_CS1/DDR1_CA0) ; port DDR5_C0_1_CA0
DDR5_C0_1_CA1: U1401.BE17(DDR0_ODT2/DDR1_CA1) ; port DDR5_C0_1_CA1
DDR5_C0_1_CA2: U1401.BE18(DDR0_MA13/DDR1_CA2) ; port DDR5_C0_1_CA2
DDR5_C0_1_CA3: U1401.BF18(DDR0_ODT0/DDR1_CA3) ; port DDR5_C0_1_CA3
DDR5_C0_1_CA4: U1401.BC19(DDR0_MA15/DDR1_CA4) ; port DDR5_C0_1_CA4
DDR5_C0_1_CA5: U1401.BD19(DDR0_CS2/DDR1_CA5) ; port DDR5_C0_1_CA5
DDR5_C0_1_CA6: U1401.BE19(DDR0_CS0/DDR1_CA6) ; port DDR5_C0_1_CA6
DDR5_C0_1_CA7: U1401.BE20(DDR0_MA14/DDR1_CA7) ; port DDR5_C0_1_CA7
DDR5_C0_1_CA8: U1401.BF20(DDR0_MA16/DDR1_CA8) ; port DDR5_C0_1_CA8
DDR5_C0_1_CA9: U1401.BC21(DDR0_BA0/DDR1_CA9) ; port DDR5_C0_1_CA9
DDR5_C0_1_CA10: U1401.BD21(DDR0_MA10/DDR1_CA10) ; port DDR5_C0_1_CA10
DDR5_C0_1_CA11: U1401.BE21(DDR0_BA1/DDR1_CA11) ; port DDR5_C0_1_CA11
DDR5_C0_1_CA12: U1401.BE22(DDR0_MA0/DDR1_CA12) ; port DDR5_C0_1_CA12
DDR5_C0_1_CK2_DN: U1401.AV24(NC/DDR1_CLKN2) ; port DDR5_C0_1_CK2_DN
DDR5_C0_1_CK2_DP: U1401.AU24(NC/DDR1_CLKP2) ; port DDR5_C0_1_CK2_DP
DDR5_C0_1_CK3_DN: U1401.AU25(NC/DDR1_CLKN3) ; port DDR5_C0_1_CK3_DN
DDR5_C0_1_CK3_DP: U1401.AT25(NC/DDR1_CLKP3) ; port DDR5_C0_1_CK3_DP
DDR5_C0_1_CS2_N: U1401.BE16(NC/DDR1_CS2) ; port DDR5_C0_1_CS2_N
DDR5_C0_1_CS3_N: U1401.BC16(NC/DDR1_CS3) ; port DDR5_C0_1_CS3_N
DDR5_C0_1_DQ0_0: U1401.BC11(DDR0_DQ4_2/DDR1_DQ0_2/DDR1_DQ0_2) ; port DDR5_C0_1_DQ0_0
DDR5_C0_1_DQ0_1: U1401.BE11(DDR0_DQ4_1/DDR1_DQ0_1/DDR1_DQ0_1) ; port DDR5_C0_1_DQ0_1
DDR5_C0_1_DQ0_2: U1401.BE10(DDR0_DQ4_0/DDR1_DQ0_0/DDR1_DQ0_0) ; port DDR5_C0_1_DQ0_2
DDR5_C0_1_DQ0_3: U1401.BD11(DDR0_DQ4_3/DDR1_DQ0_3/DDR1_DQ0_3) ; port DDR5_C0_1_DQ0_3
DDR5_C0_1_DQ0_4: U1401.BC8(DDR0_DQ4_7/DDR1_DQ0_7/DDR1_DQ0_7) ; port DDR5_C0_1_DQ0_4
DDR5_C0_1_DQ0_5: U1401.BE8(DDR0_DQ4_6/DDR1_DQ0_6/DDR1_DQ0_6) ; port DDR5_C0_1_DQ0_5
DDR5_C0_1_DQ0_6: U1401.BD8(DDR0_DQ4_4/DDR1_DQ0_4/DDR1_DQ0_4) ; port DDR5_C0_1_DQ0_6
DDR5_C0_1_DQ0_7: U1401.BE9(DDR0_DQ4_5/DDR1_DQ0_5/DDR1_DQ0_5) ; port DDR5_C0_1_DQ0_7
DDR5_C0_1_DQ1_0: U1401.BF6(DDR0_DQ5_1/DDR1_DQ1_1/DDR1_DQ1_1) ; port DDR5_C0_1_DQ1_0
DDR5_C0_1_DQ1_1: U1401.BE6(DDR0_DQ5_0/DDR1_DQ1_0/DDR1_DQ1_0) ; port DDR5_C0_1_DQ1_1
DDR5_C0_1_DQ1_2: U1401.BD6(DDR0_DQ5_2/DDR1_DQ1_2/DDR1_DQ1_2) ; port DDR5_C0_1_DQ1_2
DDR5_C0_1_DQ1_3: U1401.BC6(DDR0_DQ5_3/DDR1_DQ1_3/DDR1_DQ1_3) ; port DDR5_C0_1_DQ1_3
DDR5_C0_1_DQ1_4: U1401.BC5(DDR0_DQ5_5/DDR1_DQ1_5/DDR1_DQ1_5) ; port DDR5_C0_1_DQ1_4
DDR5_C0_1_DQ1_5: U1401.BC2(DDR0_DQ5_6/DDR1_DQ1_6/DDR1_DQ1_6) ; port DDR5_C0_1_DQ1_5
DDR5_C0_1_DQ1_6: U1401.BC4(DDR0_DQ5_4/DDR1_DQ1_4/DDR1_DQ1_4) ; port DDR5_C0_1_DQ1_6
DDR5_C0_1_DQ1_7: U1401.BC3(DDR0_DQ5_7/DDR1_DQ1_7/DDR1_DQ1_7) ; port DDR5_C0_1_DQ1_7
DDR5_C0_1_DQ2_0: U1401.BA2(DDR0_DQ6_3/DDR1_DQ4_3/DDR1_DQ2_3) ; port DDR5_C0_1_DQ2_0
DDR5_C0_1_DQ2_1: U1401.BA3(DDR0_DQ6_0/DDR1_DQ4_0/DDR1_DQ2_0) ; port DDR5_C0_1_DQ2_1
DDR5_C0_1_DQ2_2: U1401.AY2(DDR0_DQ6_2/DDR1_DQ4_2/DDR1_DQ2_2) ; port DDR5_C0_1_DQ2_2
DDR5_C0_1_DQ2_3: U1401.BA4(DDR0_DQ6_1/DDR1_DQ4_1/DDR1_DQ2_1) ; port DDR5_C0_1_DQ2_3
DDR5_C0_1_DQ2_4: U1401.AV2(DDR0_DQ6_6/DDR1_DQ4_6/DDR1_DQ2_6) ; port DDR5_C0_1_DQ2_4
DDR5_C0_1_DQ2_5: U1401.AV3(DDR0_DQ6_4/DDR1_DQ4_4/DDR1_DQ2_4) ; port DDR5_C0_1_DQ2_5
DDR5_C0_1_DQ2_6: U1401.AV4(DDR0_DQ6_5/DDR1_DQ4_5/DDR1_DQ2_5) ; port DDR5_C0_1_DQ2_6
DDR5_C0_1_DQ2_7: U1401.AW2(DDR0_DQ6_7/DDR1_DQ4_7/DDR1_DQ2_7) ; port DDR5_C0_1_DQ2_7
DDR5_C0_1_DQ3_0: U1401.AT2(DDR0_DQ7_3/DDR1_DQ5_3/DDR1_DQ3_3) ; port DDR5_C0_1_DQ3_0
DDR5_C0_1_DQ3_1: U1401.AT3(DDR0_DQ7_0/DDR1_DQ5_0/DDR1_DQ3_0) ; port DDR5_C0_1_DQ3_1
DDR5_C0_1_DQ3_2: U1401.AR2(DDR0_DQ7_2/DDR1_DQ5_2/DDR1_DQ3_2) ; port DDR5_C0_1_DQ3_2
DDR5_C0_1_DQ3_3: U1401.AT4(DDR0_DQ7_1/DDR1_DQ5_1/DDR1_DQ3_1) ; port DDR5_C0_1_DQ3_3
DDR5_C0_1_DQ3_4: U1401.AN2(DDR0_DQ7_6/DDR1_DQ5_6/DDR1_DQ3_6) ; port DDR5_C0_1_DQ3_4
DDR5_C0_1_DQ3_5: U1401.AN3(DDR0_DQ7_5/DDR1_DQ5_5/DDR1_DQ3_5) ; port DDR5_C0_1_DQ3_5
DDR5_C0_1_DQ3_6: U1401.AN4(DDR0_DQ7_4/DDR1_DQ5_4/DDR1_DQ3_4) ; port DDR5_C0_1_DQ3_6
DDR5_C0_1_DQ3_7: U1401.AP2(DDR0_DQ7_7/DDR1_DQ5_7/DDR1_DQ3_7) ; port DDR5_C0_1_DQ3_7
DDR5_C0_1_DQ4_0: U1401.BE13(NC/NC/DDR1_DQ4_2) ; port DDR5_C0_1_DQ4_0
DDR5_C0_1_DQ4_1: U1401.BE14(NC/NC/DDR1_DQ4_0) ; port DDR5_C0_1_DQ4_1
DDR5_C0_1_DQ4_2: U1401.BD13(NC/NC/DDR1_DQ4_3) ; port DDR5_C0_1_DQ4_2
DDR5_C0_1_DQ4_3: U1401.BF14(NC/NC/DDR1_DQ4_1) ; port DDR5_C0_1_DQ4_3
DDR5_C0_1_DQS0_DN: U1401.BC10(DDR0_DQSN4/DDR1_DQSN0/DDR1_DQSN0) ; port DDR5_C0_1_DQS0_DN
DDR5_C0_1_DQS0_DP: U1401.BC9(DDR0_DQSP4/DDR1_DQSP0/DDR1_DQSP0) ; port DDR5_C0_1_DQS0_DP
DDR5_C0_1_DQS1_DN: U1401.BE5(DDR0_DQSN5/DDR1_DQSN1/DDR1_DQSN1) ; port DDR5_C0_1_DQS1_DN
DDR5_C0_1_DQS1_DP: U1401.BE4(DDR0_DQSP5/DDR1_DQSP1/DDR1_DQSP1) ; port DDR5_C0_1_DQS1_DP
DDR5_C0_1_DQS2_DN: U1401.AY4(DDR0_DQSN6/DDR1_DQSN4/DDR1_DQSN2) ; port DDR5_C0_1_DQS2_DN
DDR5_C0_1_DQS2_DP: U1401.AW4(DDR0_DQSP6/DDR1_DQSP4/DDR1_DQSP2) ; port DDR5_C0_1_DQS2_DP
DDR5_C0_1_DQS3_DN: U1401.AR4(DDR0_DQSN7/DDR1_DQSN5/DDR1_DQSN3) ; port DDR5_C0_1_DQS3_DN
DDR5_C0_1_DQS3_DP: U1401.AP4(DDR0_DQSP7/DDR1_DQSP5/DDR1_DQSP3) ; port DDR5_C0_1_DQS3_DP
DDR5_C0_1_DQS4_DN: U1401.BC13(NC/NC/DDR1_DQSN4) ; port DDR5_C0_1_DQS4_DN
DDR5_C0_1_DQS4_DP: U1401.BC14(NC/NC/DDR1_DQSP4) ; port DDR5_C0_1_DQS4_DP
DDR5_C0_ALERT_N: U1401.AT26(DDR0_ALERT#) ; port DDR5_C0_ALERT_N

Not connected (* = marked no-connect by the designer): U1401 AK52(DDR_VREF_CA1)* AK54(DDR_VREF_CA0)* BC17(DDR0_ODT1/DDR1_CS1)* BC40(DDR0_DQ8_5/DDR0_DQ8_5/NC)* BD15(DDR0_ODT3/NC)* BD23(DDR0_CLKN3/DDR1_CLKN0)* BD29(DDR0_CLKN1/DDR0_CLKN1)* BD37(DDR0_CKE2/DDR0_CS1)* BD40(DDR0_DQ8_4/DDR0_DQ8_4/NC)* BE23(DDR0_CLKP3/DDR1_CLKP0)* BE24(DDR0_CLKN2/DDR1_CLKN1)* BE29(DDR0_CLKP1/DDR0_CLKP1)* BE30(DDR0_CLKN0/DDR0_CLKN0)* BE31(DDR0_MA2/NC)* BE37(DDR0_CKE0/DDR0_CS0)* BE40(DDR0_DQ8_6/DDR0_DQ8_6/NC)* BE41(DDR0_DQ8_7/DDR0_DQ8_7/NC)* BF16(DDR0_CS3/DDR1_CS0)* BF22(DDR0_PAR/NC)* BF24(DDR0_CLKP2/DDR1_CLKP1)* BF30(DDR0_CLKP0/DDR0_CLKP0)* BF38(DDR0_CKE3/NC)*